# Altium project FRONT.PrjPcb (part 1 of 2)
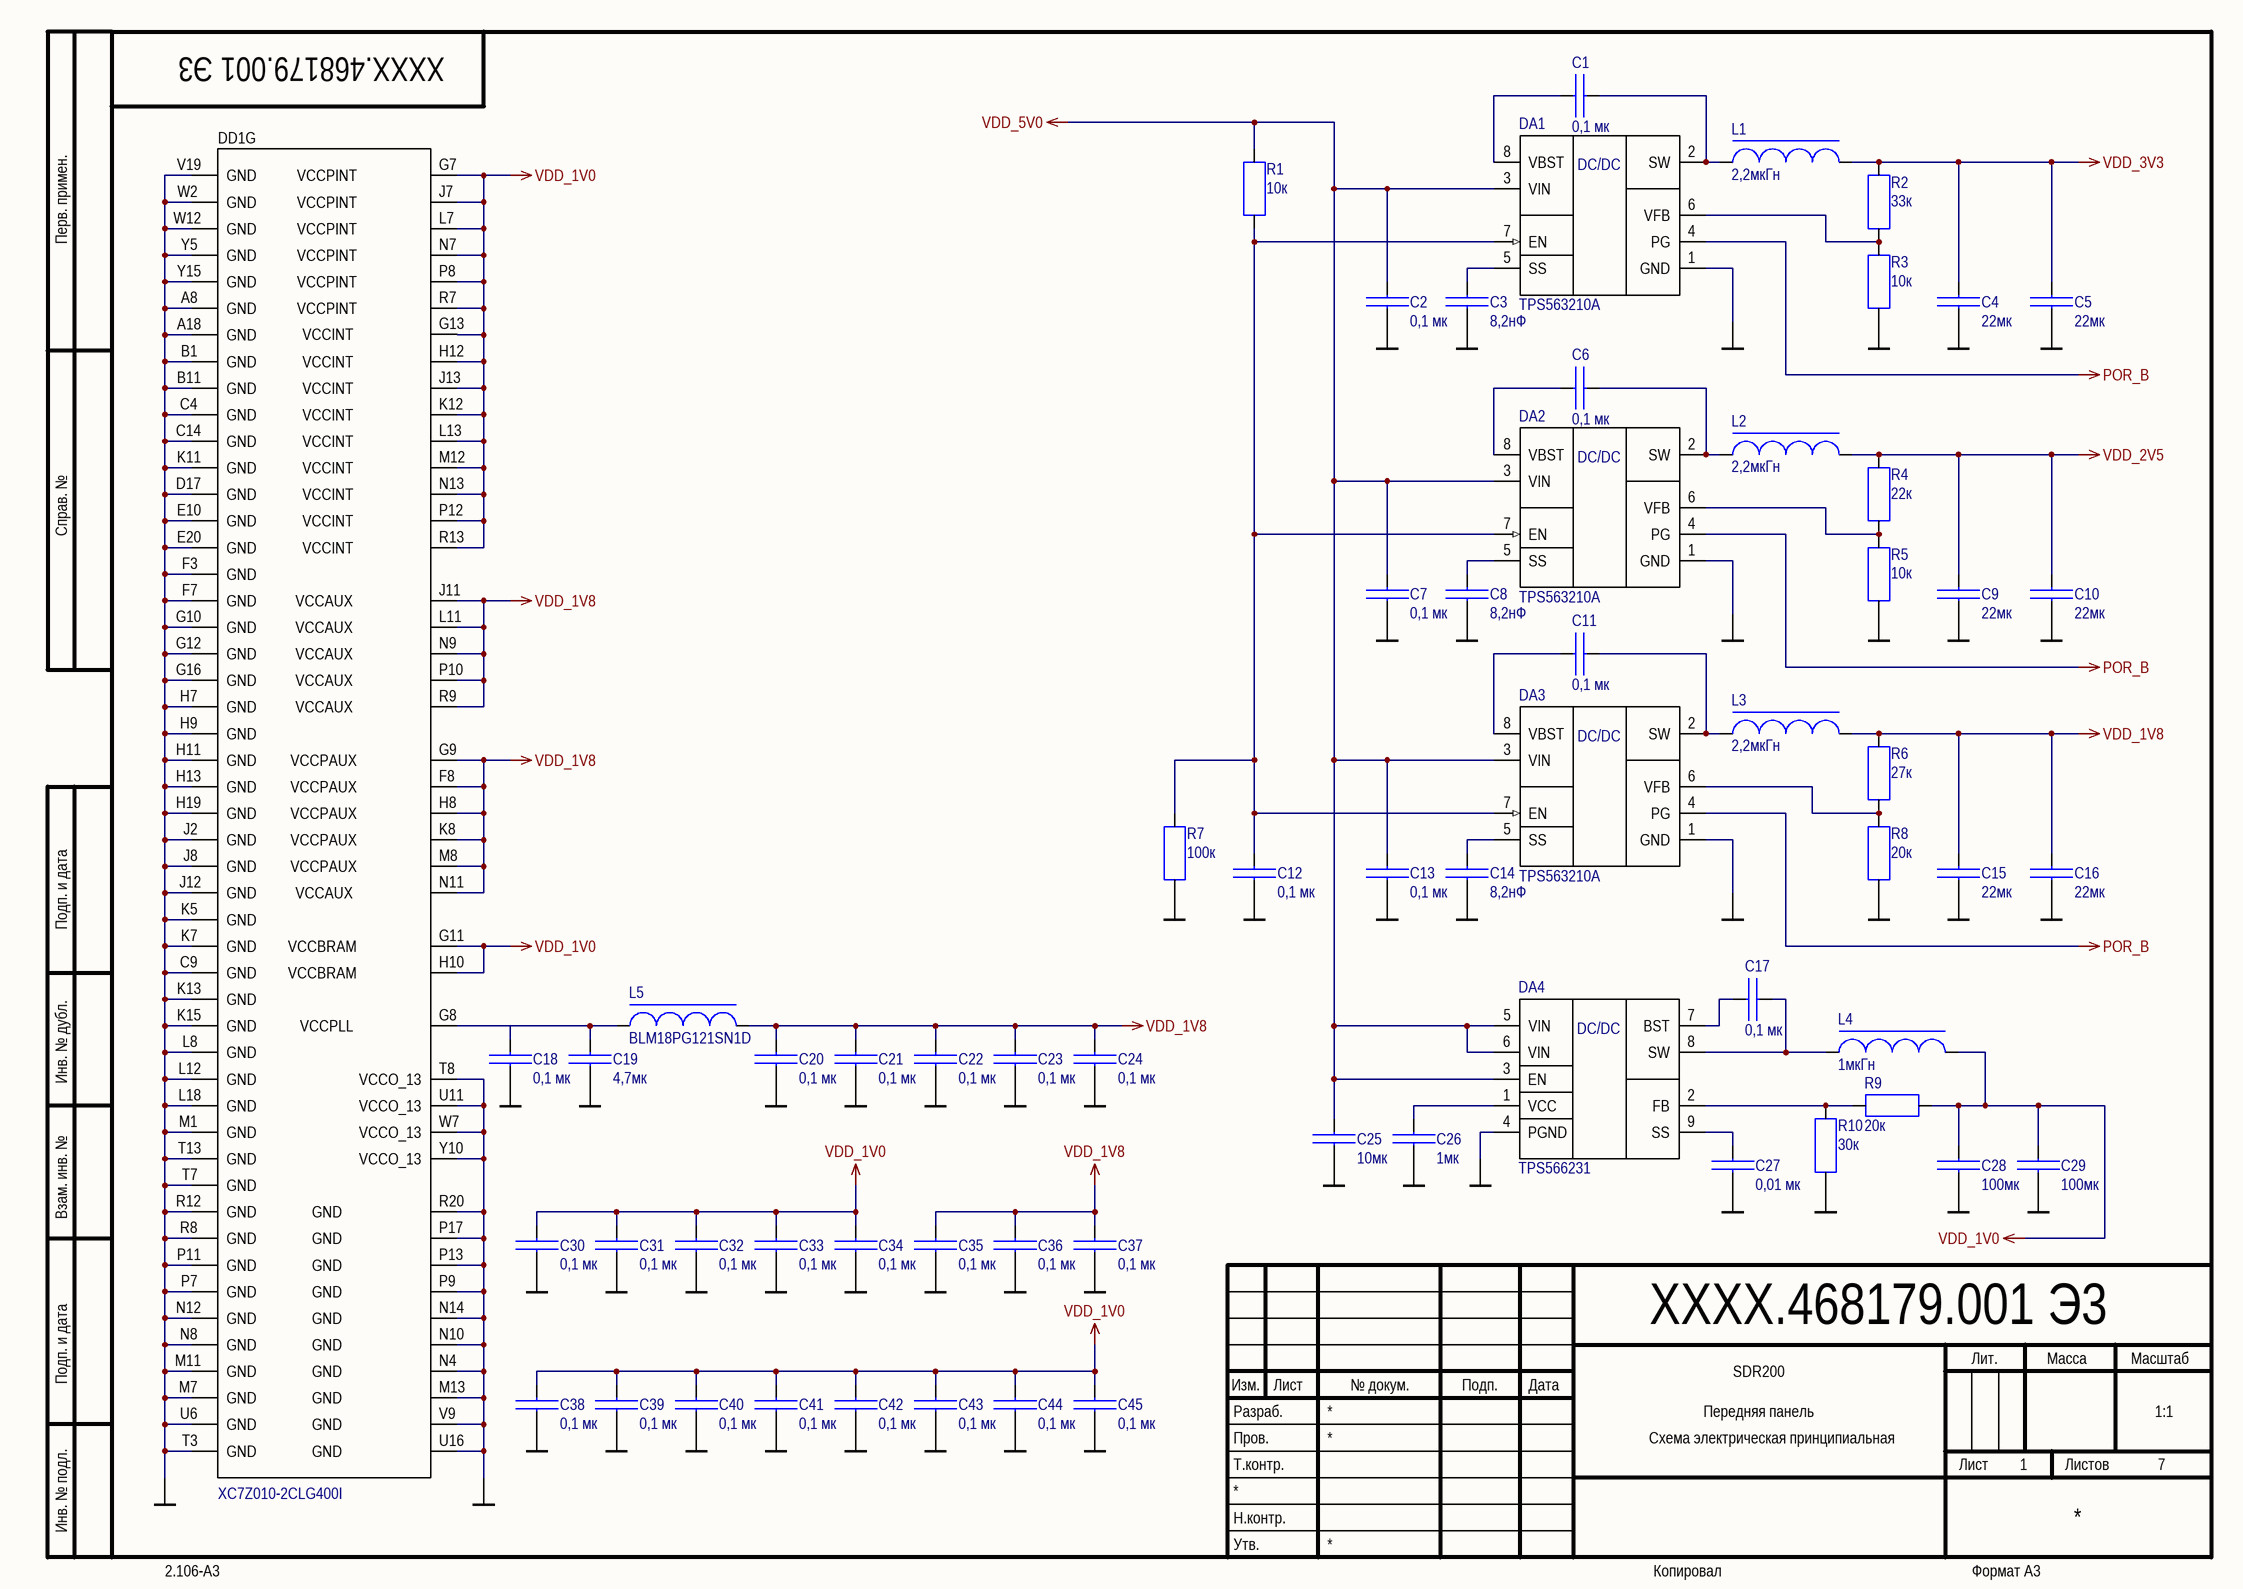
[diagram p0: FRONT_PWR.SchDoc]
7 sheets, 321 parts. Net scope: global (net labels, ports and power ports of the same name join across sheets).
Board file: FRONT_v1.PcbDoc
Sheets:
  FRONT_PWR.SchDoc
  FRONT_PL_v1.SchDoc
  FRONT_LCD.SchDoc
  FRONT_DDR.SchDoc
  FRONT_PS.SchDoc
  FRONT_MCU_v1.SchDoc
  FRONT_INTF.SchDoc

## Sheet FRONT_PWR.SchDoc: SDR200
size 420 x 297 mm; DocumentNumber: XXXX.468179.001 Э3; SheetNumber: 1; SheetTotal: 7; Title2str: Передняя панель; DocumentType: Схема электрическая принципиальная; Scale: 1:1

### Parts
C1  Nominal: 0,1 мк  [CAPC1005X05L]  (hidden comment: CC0402KRX5R6BB104)
C2  Nominal: 0,1 мк  [CAPC1005X05L]  (hidden comment: CC0402KRX5R6BB104)
C3  Nominal: 8,2нФ  [CAPC1005X05L]  (hidden comment: CC0402KRX7R9BB822)
C4  Nominal: 22мк  [CAPC2012X09L]  (hidden comment: CC0805MKX5R5BB226)
C5  Nominal: 22мк  [CAPC2012X09L]  (hidden comment: CC0805MKX5R5BB226)
C6  Nominal: 0,1 мк  [CAPC1005X05L]  (hidden comment: CC0402KRX5R6BB104)
C7  Nominal: 0,1 мк  [CAPC1005X05L]  (hidden comment: CC0402KRX5R6BB104)
C8  Nominal: 8,2нФ  [CAPC1005X05L]  (hidden comment: CC0402KRX7R9BB822)
C9  Nominal: 22мк  [CAPC2012X09L]  (hidden comment: CC0805MKX5R5BB226)
C10  Nominal: 22мк  [CAPC2012X09L]  (hidden comment: CC0805MKX5R5BB226)
C11  Nominal: 0,1 мк  [CAPC1005X05L]  (hidden comment: CC0402KRX5R6BB104)
C12  Nominal: 0,1 мк  [CAPC1005X05L]  (hidden comment: CC0402KRX5R6BB104)
C13  Nominal: 0,1 мк  [CAPC1005X05L]  (hidden comment: CC0402KRX5R6BB104)
C14  Nominal: 8,2нФ  [CAPC1005X05L]  (hidden comment: CC0402KRX7R9BB822)
C15  Nominal: 22мк  [CAPC2012X09L]  (hidden comment: CC0805MKX5R5BB226)
C16  Nominal: 22мк  [CAPC2012X09L]  (hidden comment: CC0805MKX5R5BB226)
C17  Nominal: 0,1 мк  [CAPC1005X05L]  (hidden comment: CC0402KRX5R6BB104)
C18  Nominal: 0,1 мк  [CAPC1005X05L]  (hidden comment: CC0402KRX5R6BB104)
C19  Nominal: 4,7мк  [CAPC1608X08L]  (hidden comment: CC0603KRX5R6BB475)
C20  Nominal: 0,1 мк  [CAPC1005X05L]  (hidden comment: CC0402KRX5R6BB104)
C21  Nominal: 0,1 мк  [CAPC1005X05L]  (hidden comment: CC0402KRX5R6BB104)
C22  Nominal: 0,1 мк  [CAPC1005X05L]  (hidden comment: CC0402KRX5R6BB104)
C23  Nominal: 0,1 мк  [CAPC1005X05L]  (hidden comment: CC0402KRX5R6BB104)
C24  Nominal: 0,1 мк  [CAPC1005X05L]  (hidden comment: CC0402KRX5R6BB104)
C25  Nominal: 10мк  [CAPC2012X09L]  (hidden comment: CC0805KKX5R8BB106)
C26  Nominal: 1мк  [CAPC1005X05L]  (hidden comment: CC0402KRX5R5BB105)
C27  Nominal: 0,01 мк  [CAPC1005X05L]  (hidden comment: CC0402KRX7R9BB103)
C28  Nominal: 100мк  [CAPC3216X12L]  (hidden comment: CC1206MKX5R5BB107)
C29  Nominal: 100мк  [CAPC3216X12L]  (hidden comment: CC1206MKX5R5BB107)
C30  Nominal: 0,1 мк  [CAPC1005X05L]  (hidden comment: CC0402KRX5R6BB104)
C31  Nominal: 0,1 мк  [CAPC1005X05L]  (hidden comment: CC0402KRX5R6BB104)
C32  Nominal: 0,1 мк  [CAPC1005X05L]  (hidden comment: CC0402KRX5R6BB104)
C33  Nominal: 0,1 мк  [CAPC1005X05L]  (hidden comment: CC0402KRX5R6BB104)
C34  Nominal: 0,1 мк  [CAPC1005X05L]  (hidden comment: CC0402KRX5R6BB104)
C35  Nominal: 0,1 мк  [CAPC1005X05L]  (hidden comment: CC0402KRX5R6BB104)
C36  Nominal: 0,1 мк  [CAPC1005X05L]  (hidden comment: CC0402KRX5R6BB104)
C37  Nominal: 0,1 мк  [CAPC1005X05L]  (hidden comment: CC0402KRX5R6BB104)
C38  Nominal: 0,1 мк  [CAPC1005X05L]  (hidden comment: CC0402KRX5R6BB104)
C39  Nominal: 0,1 мк  [CAPC1005X05L]  (hidden comment: CC0402KRX5R6BB104)
C40  Nominal: 0,1 мк  [CAPC1005X05L]  (hidden comment: CC0402KRX5R6BB104)
C41  Nominal: 0,1 мк  [CAPC1005X05L]  (hidden comment: CC0402KRX5R6BB104)
C42  Nominal: 0,1 мк  [CAPC1005X05L]  (hidden comment: CC0402KRX5R6BB104)
C43  Nominal: 0,1 мк  [CAPC1005X05L]  (hidden comment: CC0402KRX5R6BB104)
C44  Nominal: 0,1 мк  [CAPC1005X05L]  (hidden comment: CC0402KRX5R6BB104)
C45  Nominal: 0,1 мк  [CAPC1005X05L]  (hidden comment: CC0402KRX5R6BB104)
DA1  TPS563210A  [TSOP65P280X110-8L]
DA2  TPS563210A  [TSOP65P280X110-8L]
DA3  TPS563210A  [TSOP65P280X110-8L]
DA4  TPS566231  [VQFN-HR 9]
DD1  XC7Z010-2CLG400I  [BGA400C80P20X20_1700X1700X147]  (part G of 7)
L1  Nominal: 2,2мкГн  [INDCXGL4020]  (hidden comment: XGL4020-222ME)
L2  Nominal: 2,2мкГн  [INDCXGL4020]  (hidden comment: XGL4020-222ME)
L3  Nominal: 2,2мкГн  [INDCXGL4020]  (hidden comment: XGL4020-222ME)
L4  Nominal: 1мкГн  [INDCXGL4020]  (hidden comment: XGL4020-102ME)
L5  BLM18PG121SN1D  [INDC1608X05L]
R1  Nominal: 10к  [RESC1005X04L]  (hidden comment: RC0402JR-0710KL)
R2  Nominal: 33к  [RESC1005X04L]  (hidden comment: RC0402JR-0733KL)
R3  Nominal: 10к  [RESC1005X04L]  (hidden comment: RC0402JR-0710KL)
R4  Nominal: 22к  [RESC1005X04L]  (hidden comment: RC0402JR-0722KL)
R5  Nominal: 10к  [RESC1005X04L]  (hidden comment: RC0402JR-0710KL)
R6  Nominal: 27к  [RESC1005X04L]  (hidden comment: RC0402JR-0727KL)
R7  Nominal: 100к  [RESC1005X04L]  (hidden comment: RC0402JR-07100KL)
R8  Nominal: 20к  [RESC1005X04L]  (hidden comment: RC0402JR-0720KL)
R9  Nominal: 20к  [RESC1005X04L]  (hidden comment: RC0402JR-0720KL)
R10  Nominal: 30к  [RESC1005X04L]  (hidden comment: RC0402JR-0730KL)

### Nets
GND: C2.1 C3.1 C4.1 C5.1 C7.1 C8.1 C9.1 C10.1 C12.1 C13.1 C14.1 C15.1 C16.1 C18.2 C19.1 C20.2 C21.2 C22.2 C23.2 C24.2 C25.1 C26.1 C27.1 C28.1 C29.1 C30.2 C31.2 C32.2 C33.2 C34.2 C35.2 C36.2 C37.2 C38.2 C39.2 C40.2 C41.2 C42.2 C43.2 C44.2 C45.2 DA1.1(GND) DA2.1(GND) DA3.1(GND) DA4.4(PGND) DD1.A8(GND) DD1.A18(GND) DD1.B1(GND) DD1.B11(GND) DD1.C4(GND) DD1.C9(GND) DD1.C14(GND) DD1.D17(GND) DD1.E10(GND) DD1.E20(GND) DD1.F3(GND) DD1.F7(GND) DD1.G10(GND) DD1.G12(GND) DD1.G16(GND) DD1.H7(GND) DD1.H9(GND) DD1.H11(GND) DD1.H13(GND) DD1.H19(GND) DD1.J2(GND) DD1.J8(GND) DD1.J12(GND) DD1.K5(GND) DD1.K7(GND) DD1.K11(GND) DD1.K13(GND) DD1.K15(GND) DD1.L8(GND) DD1.L12(GND) DD1.L18(GND) DD1.M1(GND) DD1.M7(GND) DD1.M11(GND) DD1.M13(GND) DD1.N4(GND) DD1.N8(GND) DD1.N10(GND) DD1.N12(GND) DD1.N14(GND) DD1.P7(GND) DD1.P9(GND) DD1.P11(GND) DD1.P13(GND) DD1.P17(GND) DD1.R8(GND) DD1.R12(GND) DD1.R20(GND) DD1.T3(GND) DD1.T7(GND) DD1.T8(VCCO_13) DD1.T13(GND) DD1.U6(GND) DD1.U11(VCCO_13) DD1.U16(GND) DD1.V9(GND) DD1.V19(GND) DD1.W2(GND) DD1.W7(VCCO_13) DD1.W12(GND) DD1.Y5(GND) DD1.Y10(VCCO_13) DD1.Y15(GND) R3.2 R5.2 R7.1 R8.2 R10.1
POR_B: DA1.4(PG) DA2.4(PG) DA3.4(PG)
VDD_1V0: C28.2 C29.2 C30.1 C31.1 C32.1 C33.1 C34.1 C38.1 C39.1 C40.1 C41.1 C42.1 C43.1 C44.1 C45.1 DD1.G7(VCCPINT) DD1.G11(VCCBRAM) DD1.H10(VCCBRAM) DD1.H12(VCCINT) DD1.J7(VCCPINT) DD1.J13(VCCINT) DD1.K12(VCCINT) DD1.L7(VCCPINT) DD1.L13(VCCINT) DD1.M12(VCCINT) DD1.N7(VCCPINT) DD1.N13(VCCINT) DD1.P8(VCCPINT) DD1.P12(VCCINT) DD1.R7(VCCPINT) DD1.R13(VCCINT) L4.1 R9.1
VDD_1V8: C15.2 C16.2 C20.1 C21.1 C22.1 C23.1 C24.1 C35.1 C36.1 C37.1 DD1.F8(VCCPAUX) DD1.G9(VCCPAUX) DD1.H8(VCCPAUX) DD1.J11(VCCAUX) DD1.K8(VCCPAUX) DD1.L11(VCCAUX) DD1.M8(VCCPAUX) DD1.N9(VCCAUX) DD1.N11(VCCAUX) DD1.P10(VCCAUX) DD1.R9(VCCAUX) L3.1 L5.1 R6.1
VDD_2V5: C9.2 C10.2 L2.1 R4.1
VDD_3V3: C4.2 C5.2 L1.1 R2.1
VDD_5V0: C2.2 C7.2 C13.2 C25.2 DA1.3(VIN) DA2.3(VIN) DA3.3(VIN) DA4.3(EN) DA4.5(VIN) DA4.6(VIN) R1.1  [project net BL_PWR]
NetC1_1: C1.1 DA1.8(VBST)
NetC1_2: C1.2 DA1.2(SW) L1.2
NetC3_2: C3.2 DA1.5(SS)
NetC6_1: C6.1 DA2.8(VBST)
NetC6_2: C6.2 DA2.2(SW) L2.2
NetC8_2: C8.2 DA2.5(SS)
NetC11_1: C11.1 DA3.8(VBST)
NetC11_2: C11.2 DA3.2(SW) L3.2
NetC12_2: C12.2 DA1.7(EN) DA2.7(EN) DA3.7(EN) R1.2 R7.2
NetC14_2: C14.2 DA3.5(SS)
NetC17_1: C17.1 DA4.7(BST)
NetC17_2: C17.2 DA4.8(SW) L4.2
NetC18_1: C18.1 C19.2 DD1.G8(VCCPLL) L5.2
NetC26_2: C26.2 DA4.1(VCC)
NetC27_2: C27.2 DA4.9(SS)
NetDA1_6: DA1.6(VFB) R2.2 R3.1
NetDA2_6: DA2.6(VFB) R4.2 R5.1
NetDA3_6: DA3.6(VFB) R6.2 R8.1
NetDA4_2: DA4.2(FB) R9.2 R10.2

Not connected (* = marked no-connect by the designer): DD1 G13  (VCCINT___________________)

### Notes on the sheet
- Перв. примен.
- Справ. №
- Подп. и дата
- Инв. № дубл.
- Взам. инв. №
- Разраб.
- Изм.
- Лист
- № докум.
- Подп.
- Дата
- Лит.
- Масса
- Масштаб
- Пров.
- Т.контр.
- Листов
- Инв. № подл.
- Утв.
- Н.контр.
- 2.106-A3
- Копировал
- Формат А3
- (in symbol TPS563210A) DC/DC
- (in symbol TPS566231) DC/DC

### Library data of the parts
C1 C2 C6 C7 C11-C13 C17 C18 C20-C24 C30-C45 = CC0402KRX5R6BB104: ЧИП конденсатор; Manufacturer: Yageo; ID: 0402 0,1 мкФ 10В X7R; Tolerance: 10%; Type: X7R; Value: 0402 0,1 мкФ 10В X7R; RuNominal: 0,1 мкФ; Voltage: 10В; ManufacturerPartNumber: CC0402KRX5R6BB104; Rem: *
C3 C8 C14 = CC0402KRX7R9BB822: ЧИП конденсатор; Manufacturer: Yageo; ID: 0402 8,2 нФ 50В X7R; Tolerance: 10%; Type: X7R; Value: 0402 8,2 нФ 50В X7R; RuNominal: 8,2 нФ; Voltage: 50В; ManufacturerPartNumber: CC0402KRX7R9BB822; Rem: *
C4 C5 C9 C10 C15 C16 = CC0805MKX5R5BB226: ЧИП конденсатор; Manufacturer: Yageo; ID: 0805 22 мкФ 6,3В X5R; Tolerance: 0,2; Type: X5R; Value: 0805 22 мкФ 6,3В X5R; RuNominal: 22 мкФ; Voltage: 6,3В; ManufacturerPartNumber: CC0805MKX5R5BB226; Rem: *
C19 = CC0603KRX5R6BB475: ЧИП конденсатор; Manufacturer: Yageo; ID: 0603 4,7 мкФ 10В X5R; Tolerance: 10%; Type: X5R; Value: 0603 4,7 мкФ 10В X5R; RuNominal: 4,7 мкФ; Voltage: 10В; ManufacturerPartNumber: CC0603KRX5R6BB475; Rem: *
C25 = CC0805KKX5R8BB106: ЧИП конденсатор; Manufacturer: Yageo; ID: 0805 10 мкФ 25В X7R; Tolerance: 0,1; Type: X7R; Value: 0805 10 мкФ 25В X7R; RuNominal: 10 мкФ; Voltage: 25В; ManufacturerPartNumber: CC0805KKX5R8BB106; Rem: *
C26 = CC0402KRX5R5BB105: ЧИП конденсатор; Manufacturer: Yageo; ID: 0402 1 мкФ 6,3В X5R; Tolerance: 10%; Type: X5R; Value: 0402 1 мкФ 6,3В X5R; RuNominal: 1 мкФ; Voltage: 6,3В; ManufacturerPartNumber: CC0402KRX5R5BB105; Rem: *
C27 = CC0402KRX7R9BB103: ЧИП конденсатор; Manufacturer: Yageo; ID: 0402 10 нФ 50В X7R; Tolerance: 10%; Type: X7R; Value: 0402 10 нФ 50В X7R; RuNominal: 10 нФ; Voltage: 50В; ManufacturerPartNumber: CC0402KRX7R9BB103; Rem: *
C28 C29 = CC1206MKX5R5BB107: ЧИП конденсатор; Manufacturer: Yageo; ID: 1206 100 мкФ 6,3В X5R; Tolerance: 20%; Type: X5R; Value: 1206 100 мкФ 6,3В X5R; RuNominal: 100 мкФ; Voltage: 6,3В; ManufacturerPartNumber: CC1206MKX5R5BB107; Rem: *
DA1-DA3 = TPS563210A: TPS56x210A, 4.5-V to 17-V Input, 2-A, 3-A Synchrono; Manufacturer: TI; Value: TPS563210A; ComponentLink1Description: datasheet; ComponentLink1URL: https://www.ti.com/lit/ds/symlink/tps563210a.pdf?ts=1769179342855&ref_url=https%253A%252F%252Fwww.ti.com%252Fproduct%252FTPS563210A; ManufacturerPartNumber: TPS563210A; Rem: *
DA4 = TPS566231: 3-V to 18-V Input, 6-A Synchronous Step-Down Voltage Regulator; Value: TPS566231; ComponentLink1Description: datasheet; ComponentLink1URL: https://www.ti.com/lit/ds/symlink/tps566231.pdf?ts=1764277568408
DD1 = XC7Z010-2CLG400I: Zynq®-7000 SoC Family; Manufacturer: Xilinx; ManufacturerPartNumber: XC7Z010-2CLG400I; Value: XC7Z010-2CLG400I
L1-L3 = XGL4020-222ME: Shielded Power Inductors; Manufacturer: Coilcraft; ID: XGL4020 2,2мкГн; Value: XGL4020 2,2мкГн; Current: 2,7А; DC Res: 19,5mOhms; ManufacturerPartNumber: XGL4020-222ME
L4 = XGL4020-102ME: Shielded Power Inductors; Manufacturer: Coilcraft; ID: XGL4020 1мкГн; Value: XGL4020 1мкГн; Current: 3,8А; DC Res: 8,2mOhms; ManufacturerPartNumber: XGL4020-102ME
L5 = BLM18PG121SN1D: Chip Ferrite Beads (0603 Size); Manufacturer: Murata; Rem: 120ohm ±25%; Current: 2000mA; DC Res: 0.05ohm; Nominal: BLM18PG121SN1D; ID: BLM18PG121SN1D; ManufacturerPartNumber: BLM18PG121SN1D; Value: BLM18PG121SN1D
R1 R3 R5 = RC0402JR-0710KL: ЧИП резистор; Manufacturer: Yageo; ID: 0402 10 кОм 5%; Tolerance: 5%; Value: 0402 10 кОм 5%; ManufacturerPartNumber: RC0402JR-0710KL; Rem: *; Type: *
R2 = RC0402JR-0733KL: ЧИП резистор; Manufacturer: Yageo; ID: 0402 33 кОм 5%; Tolerance: 5%; Value: 0402 33 кОм 5%; ManufacturerPartNumber: RC0402JR-0733KL; Rem: *; Type: *
R4 = RC0402JR-0722KL: ЧИП резистор; Manufacturer: Yageo; ID: 0402 22 кОм 5%; Tolerance: 5%; Value: 0402 22 кОм 5%; ManufacturerPartNumber: RC0402JR-0722KL; Rem: *; Type: *
R6 = RC0402JR-0727KL: ЧИП резистор; Manufacturer: Yageo; ID: 0402 27 кОм 5%; Tolerance: 5%; Value: 0402 27 кОм 5%; ManufacturerPartNumber: RC0402JR-0727KL; Rem: *; Type: *
R7 = RC0402JR-07100KL: ЧИП резистор; Manufacturer: Yageo; ID: 0402 100 кОм 5%; Tolerance: 5%; Value: 0402 100 кОм 5%; ManufacturerPartNumber: RC0402JR-07100KL; Rem: *; Type: *
R8 R9 = RC0402JR-0720KL: ЧИП резистор; Manufacturer: Yageo; ID: 0402 20 кОм 5%; Tolerance: 5%; Value: 0402 20 кОм 5%; ManufacturerPartNumber: RC0402JR-0720KL; Rem: *; Type: *
R10 = RC0402JR-0730KL: ЧИП резистор; Manufacturer: Yageo; ID: 0402 30 кОм 5%; Tolerance: 5%; Value: 0402 30 кОм 5%; ManufacturerPartNumber: RC0402JR-0730KL; Rem: *; Type: *

## Sheet FRONT_PL_v1.SchDoc: SDR200
size 420 x 297 mm; DocumentNumber: XXXX.468179.001 Э3; SheetNumber: 2; SheetTotal: 7; Title2str: Передняя панель; DocumentType: Схема электрическая принципиальная; Scale: 1:1
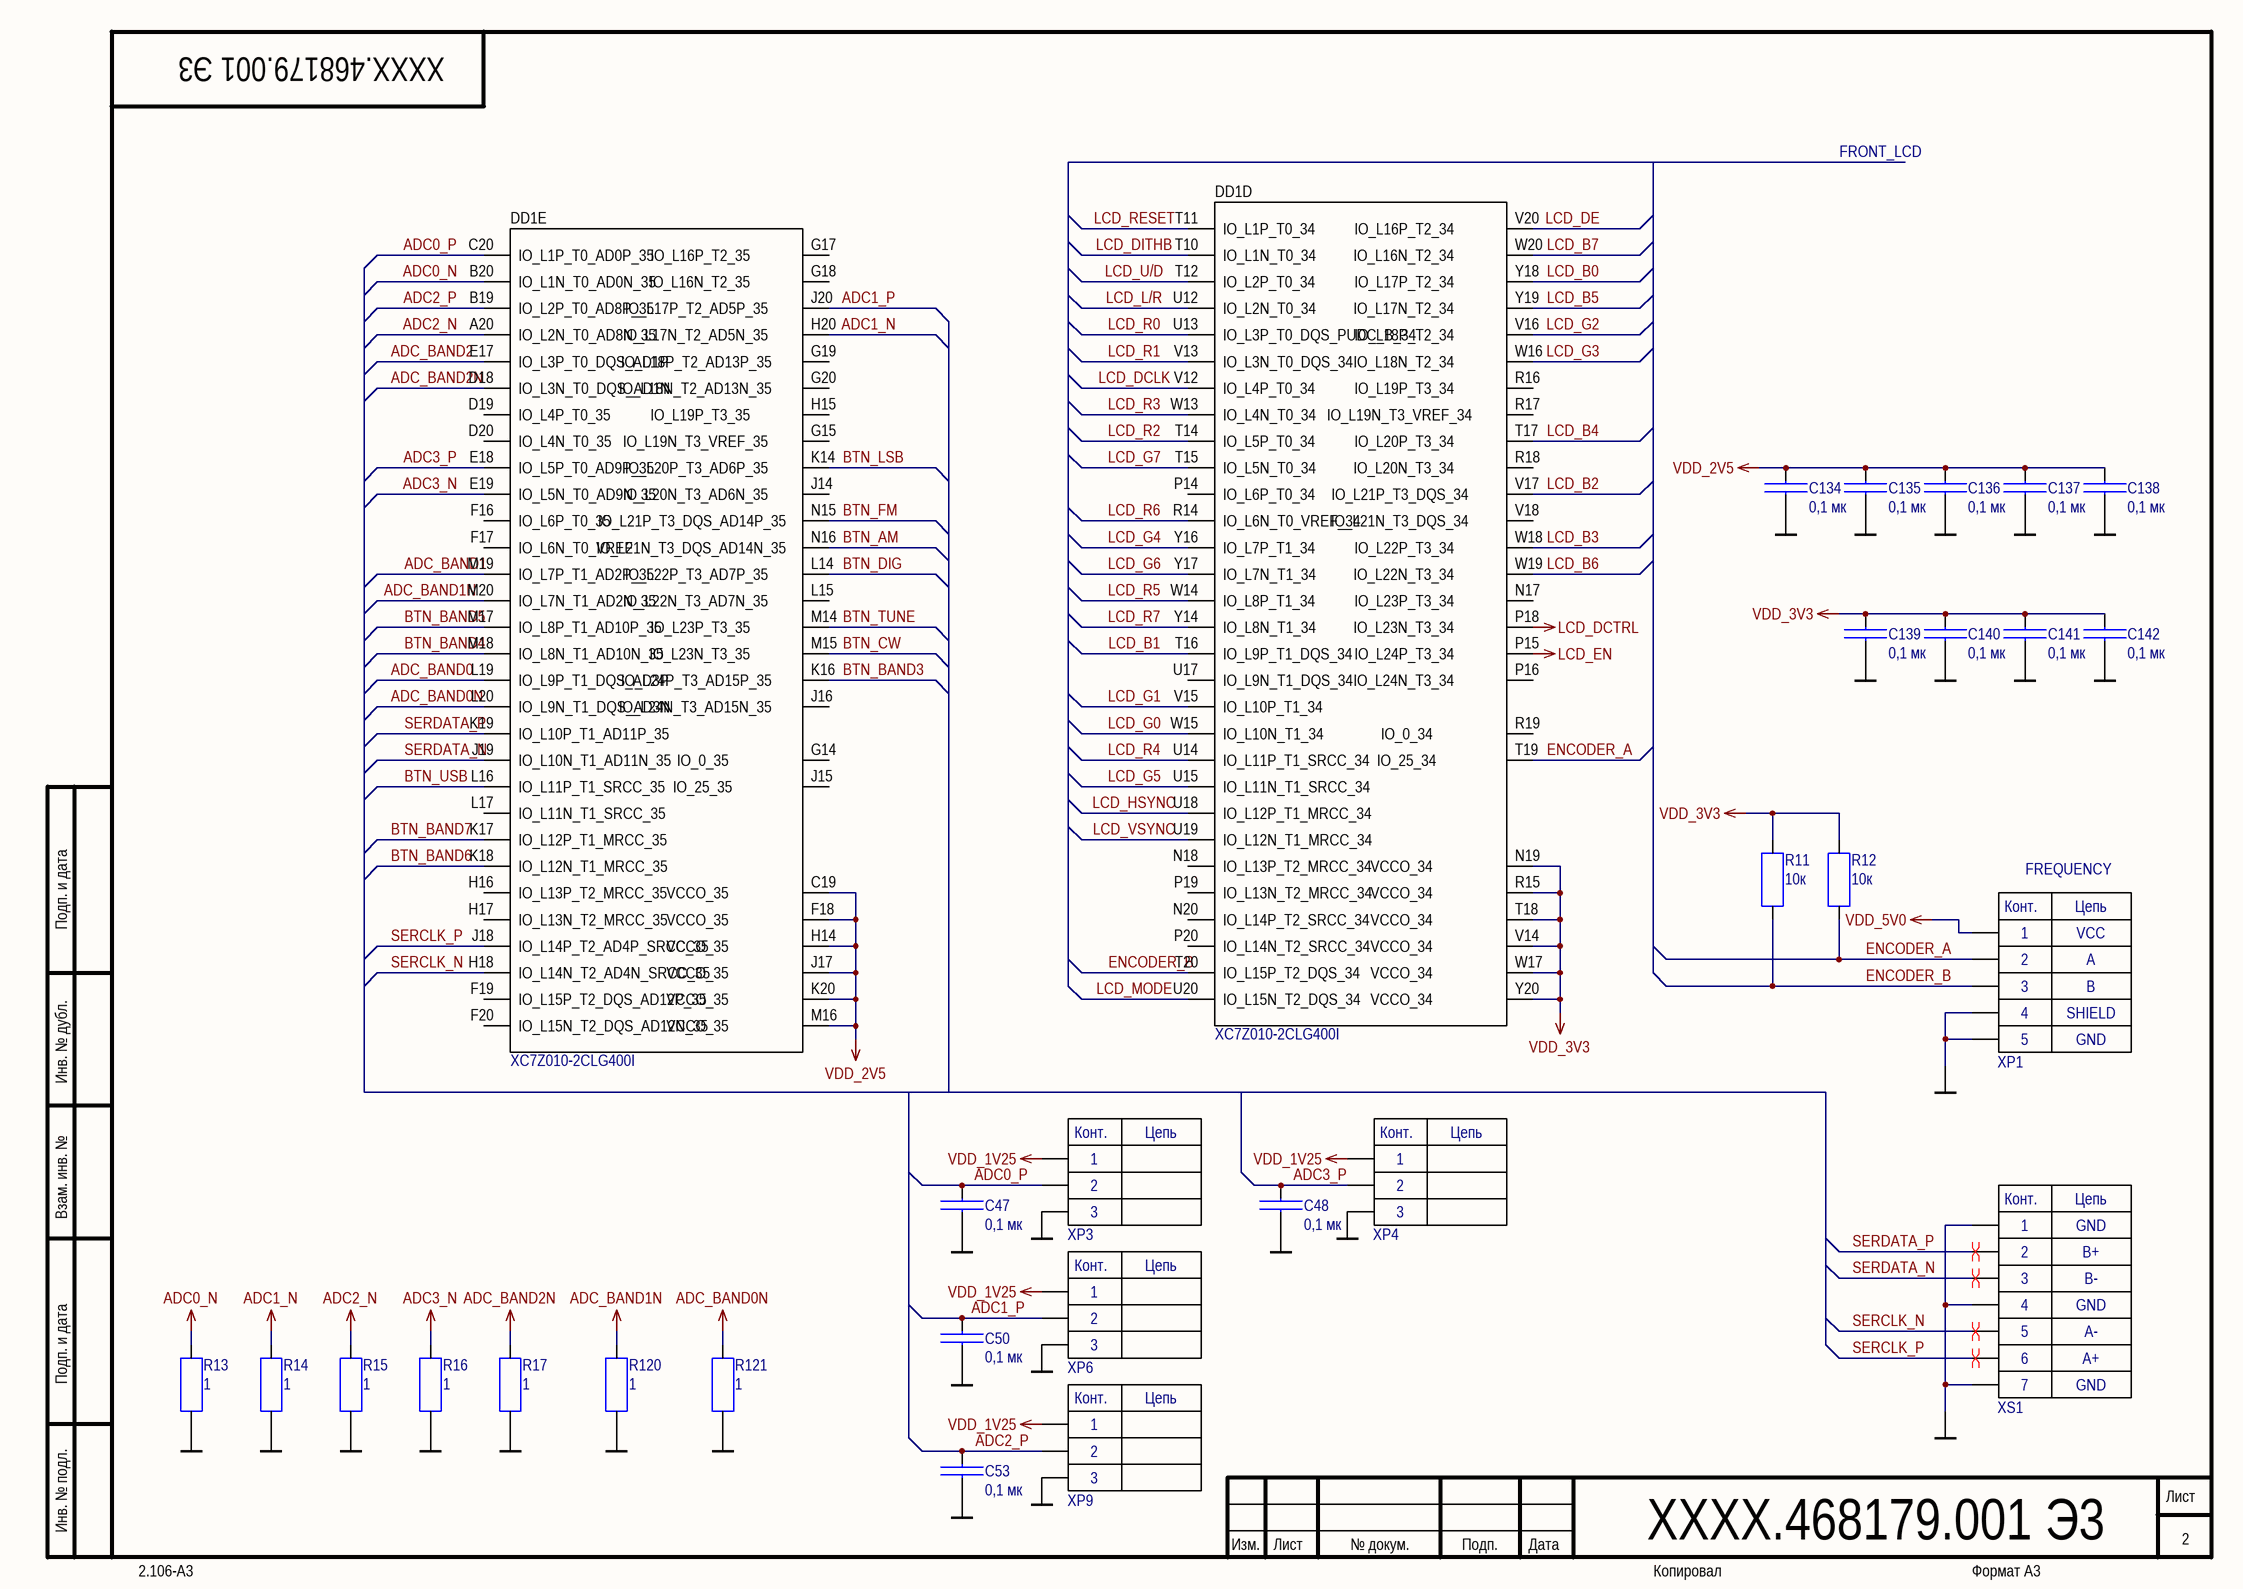
[diagram p1: FRONT_PL_v1.SchDoc]

### Parts
C47  Nominal: 0,1 мк  [CAPC1005X05L]  (hidden comment: CC0402KRX5R6BB104)
C48  Nominal: 0,1 мк  [CAPC1005X05L]  (hidden comment: CC0402KRX5R6BB104)
C50  Nominal: 0,1 мк  [CAPC1005X05L]  (hidden comment: CC0402KRX5R6BB104)
C53  Nominal: 0,1 мк  [CAPC1005X05L]  (hidden comment: CC0402KRX5R6BB104)
C134  Nominal: 0,1 мк  [CAPC1005X05L]  (hidden comment: CC0402KRX5R6BB104)
C135  Nominal: 0,1 мк  [CAPC1005X05L]  (hidden comment: CC0402KRX5R6BB104)
C136  Nominal: 0,1 мк  [CAPC1005X05L]  (hidden comment: CC0402KRX5R6BB104)
C137  Nominal: 0,1 мк  [CAPC1005X05L]  (hidden comment: CC0402KRX5R6BB104)
C138  Nominal: 0,1 мк  [CAPC1005X05L]  (hidden comment: CC0402KRX5R6BB104)
C139  Nominal: 0,1 мк  [CAPC1005X05L]  (hidden comment: CC0402KRX5R6BB104)
C140  Nominal: 0,1 мк  [CAPC1005X05L]  (hidden comment: CC0402KRX5R6BB104)
C141  Nominal: 0,1 мк  [CAPC1005X05L]  (hidden comment: CC0402KRX5R6BB104)
C142  Nominal: 0,1 мк  [CAPC1005X05L]  (hidden comment: CC0402KRX5R6BB104)
DD1  XC7Z010-2CLG400I  [BGA400C80P20X20_1700X1700X147]  (parts D,E of 7)
R11  Nominal: 10к  [RESC1005X04L]  (hidden comment: RC0402JR-0710KL)
R12  Nominal: 10к  [RESC1005X04L]  (hidden comment: RC0402JR-0710KL)
R13  Nominal: 1  [RESC1005X04L]  (hidden comment: RC0402JR-071RL)
R14  Nominal: 1  [RESC1005X04L]  (hidden comment: RC0402JR-071RL)
R15  Nominal: 1  [RESC1005X04L]  (hidden comment: RC0402JR-071RL)
R16  Nominal: 1  [RESC1005X04L]  (hidden comment: RC0402JR-071RL)
R17  Nominal: 1  [RESC1005X04L]  (hidden comment: RC0402JR-071RL)
R120  Nominal: 1  [RESC1005X04L]  (hidden comment: RC0402JR-071RL)
R121  Nominal: 1  [RESC1005X04L]  (hidden comment: RC0402JR-071RL)
XP1  WB-05  [WB-05 (MW-5M) pitch 2.00mm]  (value not drawn)
XP3  WB-03  [WB-03 (MW-3M) PITCH 2.00MM]  (value not drawn)
XP4  WB-03  [WB-03 (MW-3M) PITCH 2.00MM]  (value not drawn)
XP6  WB-03  [WB-03 (MW-3M) PITCH 2.00MM]  (value not drawn)
XP9  WB-03  [WB-03 (MW-3M) PITCH 2.00MM]  (value not drawn)
XS1  KLS1-SATA001  [KLS1-SATA001]  (value not drawn)

### Nets
ADC0_N: DD1.B20(IO_L1N_T0_AD0N_35) R13.2
ADC1_N: DD1.H20(IO_L17N_T2_AD5N_35) R14.2
ADC2_N: DD1.A20(IO_L2N_T0_AD8N_35) R15.2
ADC3_N: DD1.E19(IO_L5N_T0_AD9N_35) R16.2
ADC_BAND0N: DD1.L20(IO_L9N_T1_DQS_AD3N) R121.2
ADC_BAND1N: DD1.M20(IO_L7N_T1_AD2N_35) R120.2
ADC_BAND2N: DD1.D18(IO_L3N_T0_DQS_AD1N) R17.2
GND: C47.1 C48.1 C50.1 C53.1 C134.1 C135.1 C136.1 C137.1 C138.1 C139.1 C140.1 C141.1 C142.1 R13.1 R14.1 R15.1 R16.1 R17.1 R120.1 R121.1 XP1.4 XP1.5 XP3.3 XP4.3 XP6.3 XP9.3 XS1.1 XS1.4 XS1.7
LCD_DCTRL: DD1.P18(IO_L23N_T3_34)
LCD_EN: DD1.P15(IO_L24P_T3_34)
VDD_1V25: XP3.1 XP4.1 XP6.1 XP9.1
VDD_2V5: C134.2 C135.2 C136.2 C137.2 C138.2 DD1.C19(VCCO_35) DD1.F18(VCCO_35) DD1.H14(VCCO_35) DD1.J17(VCCO_35) DD1.K20(VCCO_35) DD1.M16(VCCO_35)
VDD_3V3: C139.2 C140.2 C141.2 C142.2 DD1.N19(VCCO_34) DD1.R15(VCCO_34) DD1.T18(VCCO_34) DD1.V14(VCCO_34) DD1.W17(VCCO_34) DD1.Y20(VCCO_34) R11.1 R12.1
VDD_5V0: XP1.1  [project net BL_PWR]
ADC0_P: C47.2 DD1.C20(IO_L1P_T0_AD0P_35) XP3.2
ADC1_P: C50.2 DD1.J20(IO_L17P_T2_AD5P_35) XP6.2
ADC2_P: C53.2 DD1.B19(IO_L2P_T0_AD8P_35) XP9.2
ADC3_P: C48.2 DD1.E18(IO_L5P_T0_AD9P_35) XP4.2
ADC_BAND0: DD1.L19(IO_L9P_T1_DQS_AD3P)
ADC_BAND1: DD1.M19(IO_L7P_T1_AD2P_35)
ADC_BAND2: DD1.E17(IO_L3P_T0_DQS_AD1P)
BTN_AM: DD1.N16(IO_L21N_T3_DQS_AD14N_35)
BTN_BAND3: DD1.K16(IO_L24P_T3_AD15P_35)
BTN_BAND4: DD1.M18(IO_L8N_T1_AD10N_35)
BTN_BAND5: DD1.M17(IO_L8P_T1_AD10P_35)
BTN_BAND6: DD1.K18(IO_L12N_T1_MRCC_35)
BTN_BAND7: DD1.K17(IO_L12P_T1_MRCC_35)
BTN_CW: DD1.M15(IO_L23N_T3_35)
BTN_DIG: DD1.L14(IO_L22P_T3_AD7P_35)
BTN_FM: DD1.N15(IO_L21P_T3_DQS_AD14P_35)
BTN_LSB: DD1.K14(IO_L20P_T3_AD6P_35)
BTN_TUNE: DD1.M14(IO_L23P_T3_35)
BTN_USB: DD1.L16(IO_L11P_T1_SRCC_35)
ENCODER_A: DD1.T19(IO_25_34) R12.2 XP1.2
ENCODER_B: DD1.T20(IO_L15P_T2_DQS_34) R11.2 XP1.3
LCD_B0: DD1.Y18(IO_L17P_T2_34)
LCD_B1: DD1.T16(IO_L9P_T1_DQS_34)
LCD_B2: DD1.V17(IO_L21P_T3_DQS_34)
LCD_B3: DD1.W18(IO_L22P_T3_34)
LCD_B4: DD1.T17(IO_L20P_T3_34)
LCD_B5: DD1.Y19(IO_L17N_T2_34)
LCD_B6: DD1.W19(IO_L22N_T3_34)
LCD_B7: DD1.W20(IO_L16N_T2_34)
LCD_DCLK: DD1.V12(IO_L4P_T0_34)
LCD_DE: DD1.V20(IO_L16P_T2_34)
LCD_DITHB: DD1.T10(IO_L1N_T0_34)
LCD_G0: DD1.W15(IO_L10N_T1_34)
LCD_G1: DD1.V15(IO_L10P_T1_34)
LCD_G2: DD1.V16(IO_L18P_T2_34)
LCD_G3: DD1.W16(IO_L18N_T2_34)
LCD_G4: DD1.Y16(IO_L7P_T1_34)
LCD_G5: DD1.U15(IO_L11N_T1_SRCC_34)
LCD_G6: DD1.Y17(IO_L7N_T1_34)
LCD_G7: DD1.T15(IO_L5N_T0_34)
LCD_HSYNC: DD1.U18(IO_L12P_T1_MRCC_34)
LCD_L/R: DD1.U12(IO_L2N_T0_34)
LCD_MODE: DD1.U20(IO_L15N_T2_DQS_34)
LCD_R0: DD1.U13(IO_L3P_T0_DQS_PUDC_B_34)
LCD_R1: DD1.V13(IO_L3N_T0_DQS_34)
LCD_R2: DD1.T14(IO_L5P_T0_34)
LCD_R3: DD1.W13(IO_L4N_T0_34)
LCD_R4: DD1.U14(IO_L11P_T1_SRCC_34)
LCD_R5: DD1.W14(IO_L8P_T1_34)
LCD_R6: DD1.R14(IO_L6N_T0_VREF_34)
LCD_R7: DD1.Y14(IO_L8N_T1_34)
LCD_RESET: DD1.T11(IO_L1P_T0_34)
LCD_U/D: DD1.T12(IO_L2P_T0_34)
LCD_VSYNC: DD1.U19(IO_L12N_T1_MRCC_34)
SERCLK_N: DD1.H18(IO_L14N_T2_AD4N_SRCC_35) XS1.5
SERCLK_P: DD1.J18(IO_L14P_T2_AD4P_SRCC_35) XS1.6
SERDATA_N: DD1.J19(IO_L10N_T1_AD11N_35) XS1.3
SERDATA_P: DD1.K19(IO_L10P_T1_AD11P_35) XS1.2

Not connected (* = marked no-connect by the designer): DD1 D19  (IO_L4P_T0_35_____________) D20  (IO_L4N_T0_35_____________) F16  (IO_L6P_T0_35_____________) F17  (IO_L6N_T0_VREF) F19  (IO_L15P_T2_DQS_AD12P_35__) F20  (IO_L15N_T2_DQS_AD12N_35__) G14  (IO_0_35__________________) G15  (IO_L19N_T3_VREF_35_______) G17  (IO_L16P_T2_35____________) G18  (IO_L16N_T2_35____________) G19  (IO_L18P_T2_AD13P_35______) G20  (IO_L18N_T2_AD13N_35______) H15  (IO_L19P_T3_35____________) H16  (IO_L13P_T2_MRCC_35_______) H17  (IO_L13N_T2_MRCC_35_______) J14  (IO_L20N_T3_AD6N_35_______) J15  (IO_25_35_________________) J16  (IO_L24N_T3_AD15N_35______) L15  (IO_L22N_T3_AD7N_35_______) L17  (IO_L11N_T1_SRCC_35_______) N17  (IO_L23P_T3_34____________) N18  (IO_L13P_T2_MRCC_34_______) N20  (IO_L14P_T2_SRCC_34_______) P14  (IO_L6P_T0_34_____________) P16  (IO_L24N_T3_34____________) P19  (IO_L13N_T2_MRCC_34_______) P20  (IO_L14N_T2_SRCC_34_______) R16  (IO_L19P_T3_34____________) R17  (IO_L19N_T3_VREF_34_______) R18  (IO_L20N_T3_34____________) R19  (IO_0_34__________________) U17  (IO_L9N_T1_DQS_34_________) V18  (IO_L21N_T3_DQS_34________)

### Layout directives
differential pair: SERCLK_N, SERCLK_P, SERDATA_N, SERDATA_P

### Notes on the sheet
- FRONT_LCD
- FREQUENCY
- VCC
- A
- B
- GND
- SHIELD
- Подп. и дата
- Инв. № дубл.
- Взам. инв. №
- Инв. № подл.
- Изм.
- Лист
- № докум.
- Подп.
- Дата
- 2.106-A3
- Копировал
- Формат А3
- (in symbol SATA KLS1-SATA001) Конт.; Цепь; GND; B+; B-; A-; A+
- (in symbol WB-03) Конт.; Цепь
- (in symbol WB-05) Конт.; Цепь

### Library data of the parts
C47 C48 C50 C53 C134-C142 = CC0402KRX5R6BB104: as C1 on sheet FRONT_PWR; ManufacturerPartNumber: CC0402KRX5R6BB104; Rem: *
DD1 = XC7Z010-2CLG400I: as DD1 on sheet FRONT_PWR; ManufacturerPartNumber: XC7Z010-2CLG400I; Value: XC7Z010-2CLG400I
R11 R12 = RC0402JR-0710KL: as R1 on sheet FRONT_PWR; ManufacturerPartNumber: RC0402JR-0710KL; Rem: *; Type: *
R13-R17 R120 R121 = RC0402JR-071RL: ЧИП резистор; Manufacturer: Yageo; ID: 0402 1 Ом 5%; Tolerance: 5%; Value: 0402 1 Ом 5%; ManufacturerPartNumber: RC0402JR-071RL; Rem: *; Type: *
XP1 = WB-05: WB-05 (MW-5M) pitch 2.00mm / DS1066-05M; ManufacturerPartNumber: WB-05
XP3 XP4 XP6 XP9 = WB-03: WB-03(MW-3M) pitch 2.00mm / DS1066-03M
XS1 = SATA KLS1-SATA001: SATA Type A 7P Male Connector,SMD

## Sheet FRONT_LCD.SchDoc: SDR200
size 420 x 297 mm; DocumentNumber: XXXX.468179.001 Э3; SheetNumber: 3; SheetTotal: 7; Title2str: Передняя панель; DocumentType: Схема электрическая принципиальная; Scale: 1:1
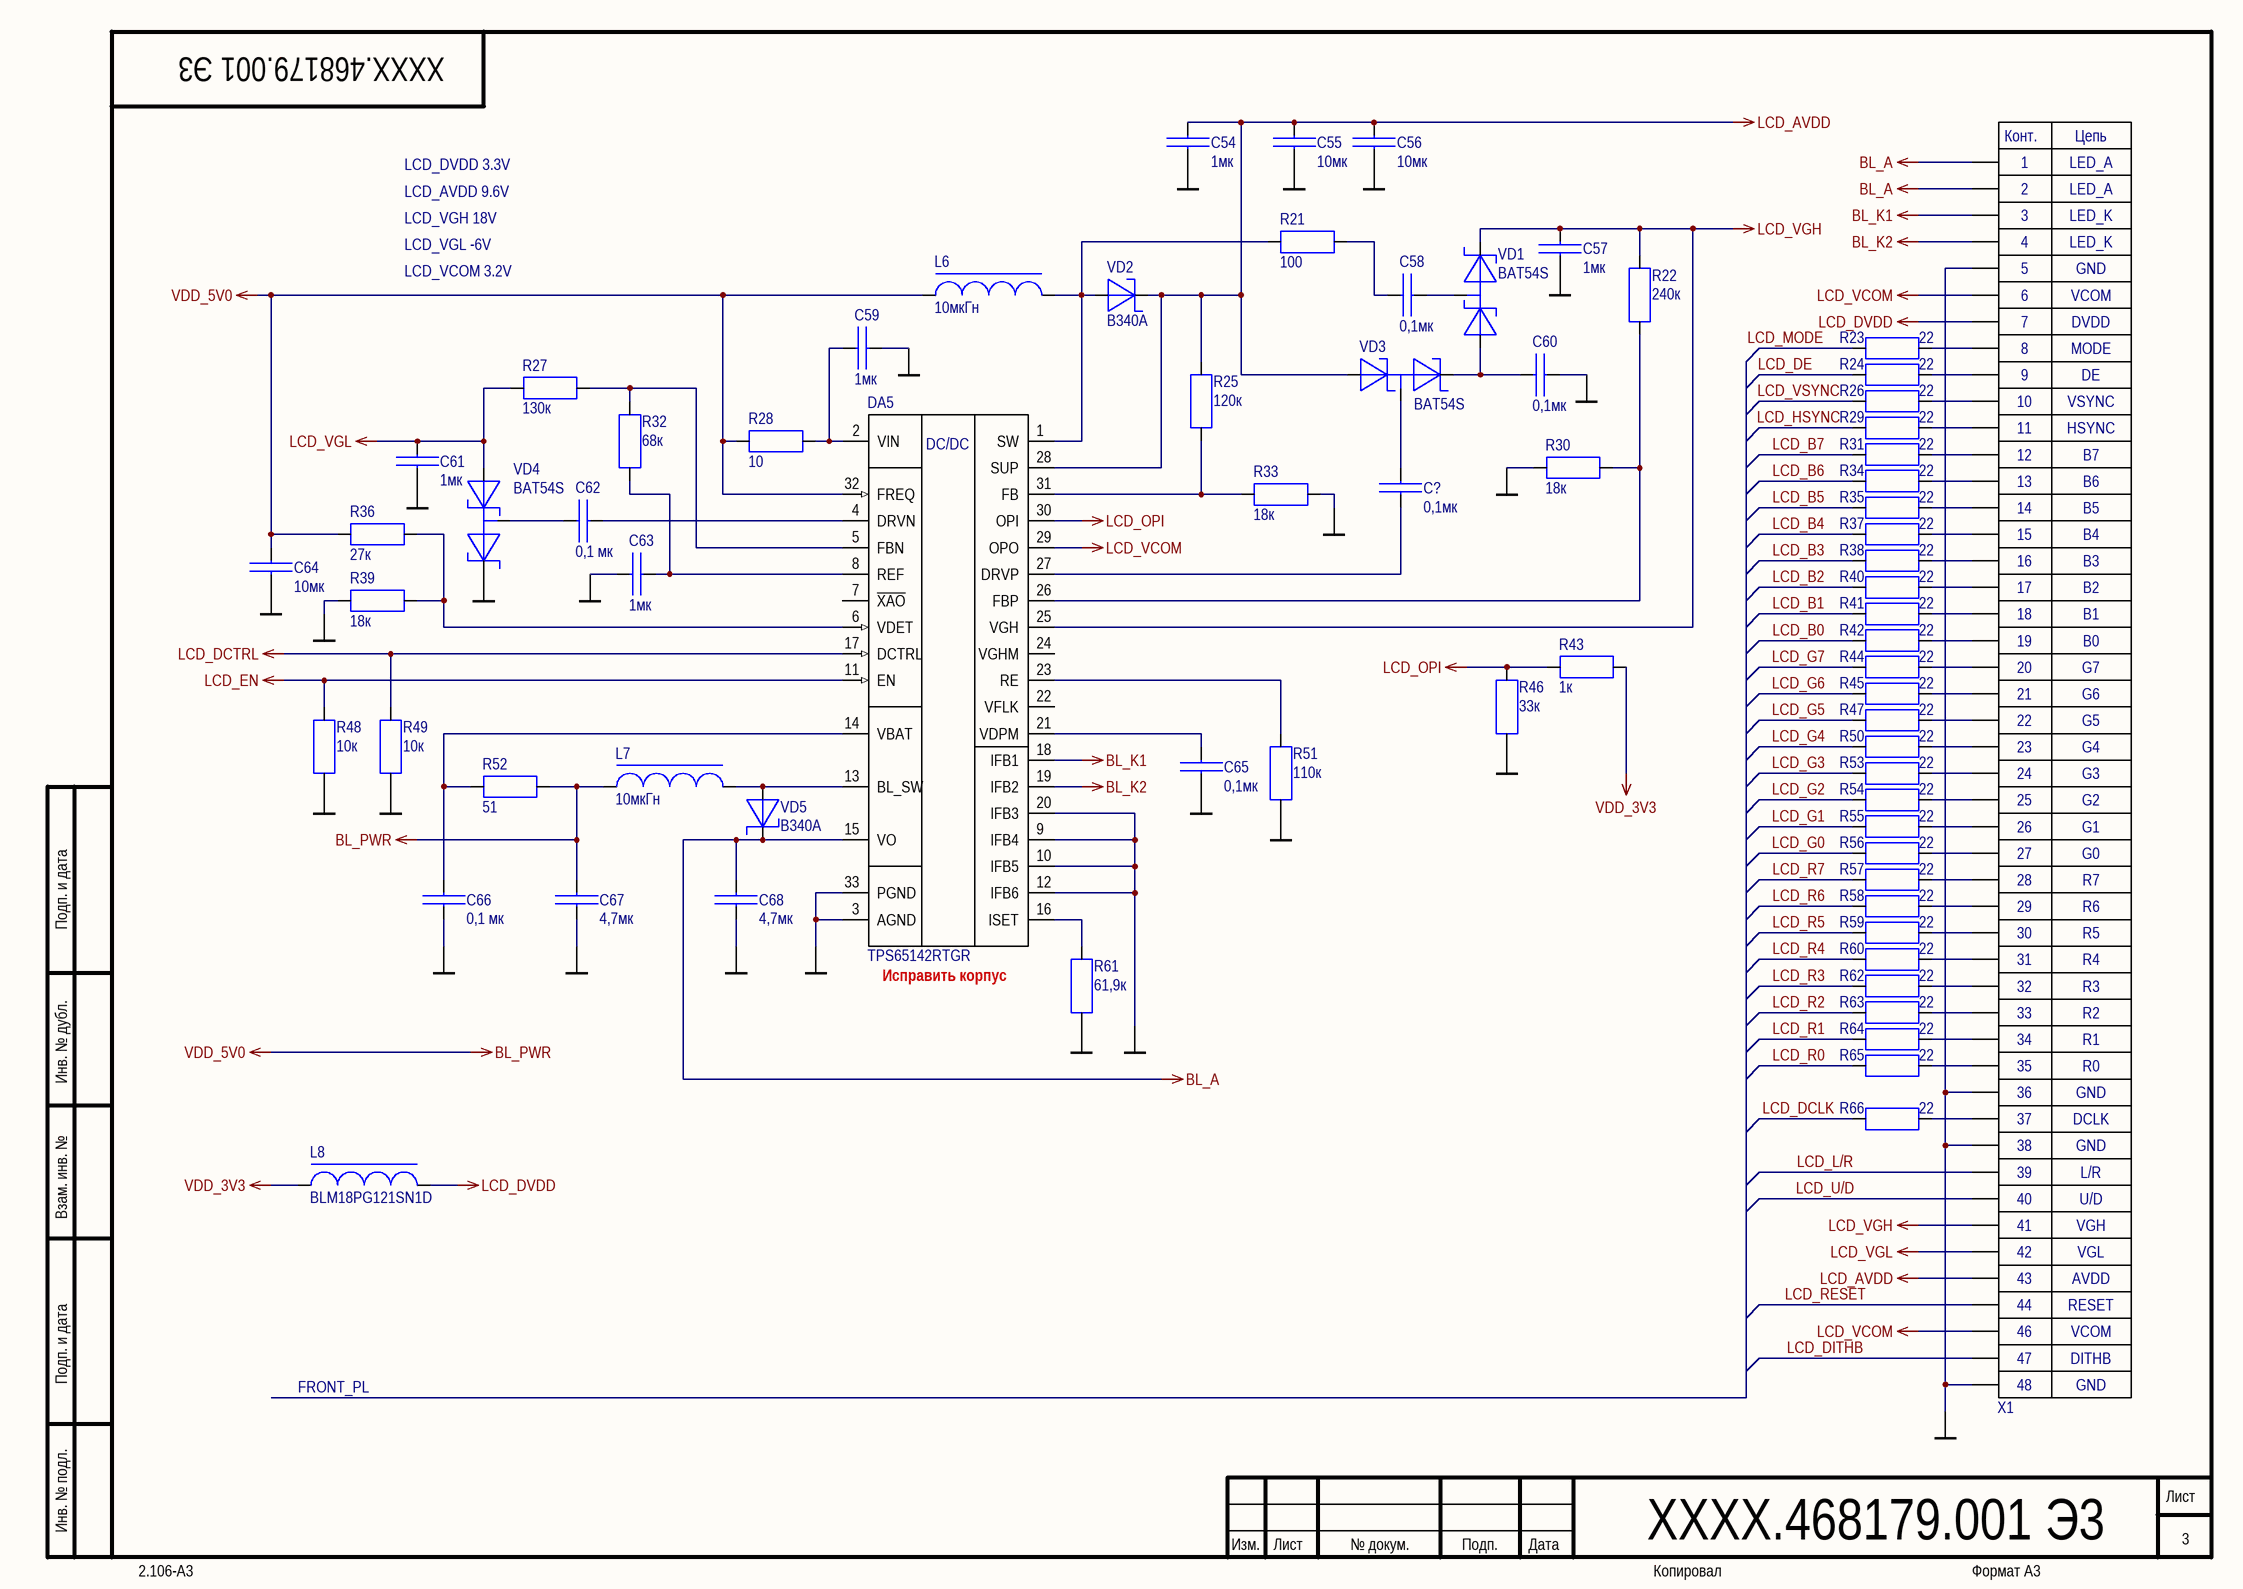
[diagram p2: FRONT_LCD.SchDoc]

### Parts
C54  Nominal: 1мк  [CAPC1608X08L]  (hidden comment: CC0603KRX7R9BB105)
C55  Nominal: 10мк  [CAPC2012X09L]  (hidden comment: CC0805KKX5R8BB106)
C56  Nominal: 10мк  [CAPC2012X09L]  (hidden comment: CC0805KKX5R8BB106)
C57  Nominal: 1мк  [CAPC1608X08L]  (hidden comment: CC0603KRX7R9BB105)
C58  Nominal: 0,1мк  [CAPC1608X08L]  (hidden comment: CC0603KRX7R9BB103)
C59  Nominal: 1мк  [CAPC1608X08L]  (hidden comment: CC0603KRX7R9BB105)
C60  Nominal: 0,1мк  [CAPC1608X08L]  (hidden comment: CC0603KRX7R9BB103)
C61  Nominal: 1мк  [CAPC1608X08L]  (hidden comment: CC0603KRX7R9BB105)
C62  Nominal: 0,1 мк  [CAPC1005X05L]  (hidden comment: CC0402KRX5R6BB104)
C63  Nominal: 1мк  [CAPC1608X08L]  (hidden comment: CC0603KRX7R9BB105)
C64  Nominal: 10мк  [CAPC2012X09L]  (hidden comment: CC0805KKX5R8BB106)
C65  Nominal: 0,1мк  [CAPC1608X08L]  (hidden comment: CC0603KRX7R9BB103)
C66  Nominal: 0,1 мк  [CAPC1005X05L]  (hidden comment: CC0402KRX5R6BB104)
C67  Nominal: 4,7мк  [CAPC2012X09L]  (hidden comment: CC0805KKX7R8BB475)
C68  Nominal: 4,7мк  [CAPC2012X09L]  (hidden comment: CC0805KKX7R8BB475)
C?  Nominal: 0,1мк  [CAPC1608X08L]  (hidden comment: CC0603KRX7R9BB103)
DA5  TPS65142RTGR  [PQFN40P600X300X80_HS-33N]
L6  Nominal: 10мкГн  [INDC1812PS]  (hidden comment: 1812PS-103KR)
L7  Nominal: 10мкГн  [INDC1812PS]  (hidden comment: 1812PS-103KR)
L8  BLM18PG121SN1D  [INDC1608X05L]
R21  Nominal: 100  [RESC1005X04L]  (hidden comment: RC0402JR-07100RL)
R22  Nominal: 240к  [RESC1005X04L]  (hidden comment: RC0402JR-07240KL)
R23  Nominal: 22  [RESC1005X04L]  (hidden comment: RC0402JR-0722RL)
R24  Nominal: 22  [RESC1005X04L]  (hidden comment: RC0402JR-0722RL)
R25  Nominal: 120к  [RESC1005X04L]  (hidden comment: RC0402JR-07120KL)
R26  Nominal: 22  [RESC1005X04L]  (hidden comment: RC0402JR-0722RL)
R27  Nominal: 130к  [RESC1005X04L]  (hidden comment: RC0402JR-07130KL)
R28  Nominal: 10  [RESC1005X04L]  (hidden comment: RC0402JR-0710RL)
R29  Nominal: 22  [RESC1005X04L]  (hidden comment: RC0402JR-0722RL)
R30  Nominal: 18к  [RESC1005X04L]  (hidden comment: RC0402JR-0718KL)
R31  Nominal: 22  [RESC1005X04L]  (hidden comment: RC0402JR-0722RL)
R32  Nominal: 68к  [RESC1005X04L]  (hidden comment: RC0402JR-0768KL)
R33  Nominal: 18к  [RESC1005X04L]  (hidden comment: RC0402JR-0718KL)
R34  Nominal: 22  [RESC1005X04L]  (hidden comment: RC0402JR-0722RL)
R35  Nominal: 22  [RESC1005X04L]  (hidden comment: RC0402JR-0722RL)
R36  Nominal: 27к  [RESC1005X04L]  (hidden comment: RC0402JR-0727KL)
R37  Nominal: 22  [RESC1005X04L]  (hidden comment: RC0402JR-0722RL)
R38  Nominal: 22  [RESC1005X04L]  (hidden comment: RC0402JR-0722RL)
R39  Nominal: 18к  [RESC1005X04L]  (hidden comment: RC0402JR-0718KL)
R40  Nominal: 22  [RESC1005X04L]  (hidden comment: RC0402JR-0722RL)
R41  Nominal: 22  [RESC1005X04L]  (hidden comment: RC0402JR-0722RL)
R42  Nominal: 22  [RESC1005X04L]  (hidden comment: RC0402JR-0722RL)
R43  Nominal: 1к  [RESC1005X04L]  (hidden comment: RC0402JR-071KL)
R44  Nominal: 22  [RESC1005X04L]  (hidden comment: RC0402JR-0722RL)
R45  Nominal: 22  [RESC1005X04L]  (hidden comment: RC0402JR-0722RL)
R46  Nominal: 33к  [RESC1005X04L]  (hidden comment: RC0402JR-0733KL)
R47  Nominal: 22  [RESC1005X04L]  (hidden comment: RC0402JR-0722RL)
R48  Nominal: 10к  [RESC1005X04L]  (hidden comment: RC0402JR-0710KL)
R49  Nominal: 10к  [RESC1005X04L]  (hidden comment: RC0402JR-0710KL)
R50  Nominal: 22  [RESC1005X04L]  (hidden comment: RC0402JR-0722RL)
R51  Nominal: 110к  [RESC1005X04L]  (hidden comment: RC0402JR-07110KL)
R52  Nominal: 51  [RESC1005X04L]  (hidden comment: RC0402JR-0751RL)
R53  Nominal: 22  [RESC1005X04L]  (hidden comment: RC0402JR-0722RL)
R54  Nominal: 22  [RESC1005X04L]  (hidden comment: RC0402JR-0722RL)
R55  Nominal: 22  [RESC1005X04L]  (hidden comment: RC0402JR-0722RL)
R56  Nominal: 22  [RESC1005X04L]  (hidden comment: RC0402JR-0722RL)
R57  Nominal: 22  [RESC1005X04L]  (hidden comment: RC0402JR-0722RL)
R58  Nominal: 22  [RESC1005X04L]  (hidden comment: RC0402JR-0722RL)
R59  Nominal: 22  [RESC1005X04L]  (hidden comment: RC0402JR-0722RL)
R60  Nominal: 22  [RESC1005X04L]  (hidden comment: RC0402JR-0722RL)
R61  Nominal: 61,9к  [RESC1005X04L]  (hidden comment: RC0402FR-0761K9L)
R62  Nominal: 22  [RESC1005X04L]  (hidden comment: RC0402JR-0722RL)
R63  Nominal: 22  [RESC1005X04L]  (hidden comment: RC0402JR-0722RL)
R64  Nominal: 22  [RESC1005X04L]  (hidden comment: RC0402JR-0722RL)
R65  Nominal: 22  [RESC1005X04L]  (hidden comment: RC0402JR-0722RL)
R66  Nominal: 22  [RESC1005X04L]  (hidden comment: RC0402JR-0722RL)
VD1  BAT54S  [SOT95P240X120-3L]
VD2  B340A  [DIOM5127X23L]
VD3  BAT54S  [SOT95P240X120-3L]
VD4  BAT54S  [SOT95P240X120-3L]
VD5  B340A  [DIOM5127X23L]
X1  LCD 50p  [CON_541325062_MOL]  (value not drawn)

### Nets
BL_A: C68.2 DA5.15(VO) VD5.1(K) X1.1 X1.2
BL_K1: DA5.18(IFB1) X1.3
BL_K2: DA5.19(IFB2) X1.4
BL_PWR: C64.1 C67.2 DA5.32(FREQ) L6.2 L7.2 R28.1 R36.1 R52.1  [also labelled VDD_5V0]
GND: C54.1 C55.2 C56.2 C57.1 C59.1 C60.2 C61.1 C63.1 C64.2 C65.1 C66.1 C67.1 C68.1 DA5.3(AGND) DA5.9(IFB4) DA5.10(IFB5) DA5.12(IFB6) DA5.20(IFB3) DA5.33(PGND) R30.1 R33.2 R39.1 R46.1 R48.2 R49.2 R51.1 R61.1 VD4.3(K) X1.5 X1.36 X1.38 X1.48
LCD_AVDD: C54.2 C55.1 C56.1 DA5.28(SUP) R25.1 VD2.1(K) VD3.2(A) X1.43
LCD_DCTRL: DA5.17(DCTRL) R49.1
LCD_DVDD: L8.1 X1.7
LCD_EN: DA5.11(EN) R48.1
LCD_OPI: DA5.30(OPI) R43.2 R46.2
LCD_VCOM: DA5.29(OPO) X1.6 X1.46
LCD_VGH: C57.2 DA5.25(VGH) R22.1 VD1.3(K) X1.41
LCD_VGL: C61.2 R27.1 VD4.2(A) X1.42
VDD_3V3: L8.2 R43.1
LCD_B0: R42.2
LCD_B1: R41.2
LCD_B2: R40.2
LCD_B3: R38.2
LCD_B4: R37.2
LCD_B5: R35.2
LCD_B6: R34.2
LCD_B7: R31.2
LCD_DCLK: R66.2
LCD_DE: R24.2
LCD_DITHB: X1.47
LCD_G0: R56.2
LCD_G1: R55.2
LCD_G2: R54.2
LCD_G3: R53.2
LCD_G4: R50.2
LCD_G5: R47.2
LCD_G6: R45.2
LCD_G7: R44.2
LCD_HSYNC: R29.2
LCD_L/R: X1.39
LCD_MODE: R23.2
LCD_R0: R65.2
LCD_R1: R64.2
LCD_R2: R63.2
LCD_R3: R62.2
LCD_R4: R60.2
LCD_R5: R59.2
LCD_R6: R58.2
LCD_R7: R57.2
LCD_RESET: X1.44
LCD_U/D: X1.40
LCD_VSYNC: R26.2
NetC58_1: C58.1 R21.1
NetC58_2: C58.2 VD1.1
NetC59_2: C59.2 DA5.2(VIN) R28.2
NetC60_1: C60.1 VD1.2(A) VD3.3(K)
NetC62_1: C62.1 DA5.4(DRVN)
NetC62_2: C62.2 VD4.1
NetC63_2: C63.2 DA5.8(REF) R32.1
NetC65_2: C65.2 DA5.21(VDPM)
NetC66_2: C66.2 DA5.14(VBAT) R52.2
NetC?_1: C?.1 DA5.27(DRVP)
NetC?_2: C?.2 VD3.1
NetDA5_1: DA5.1(SW) L6.1 R21.2 VD2.2(A)
NetDA5_5: DA5.5(FBN) R27.2 R32.2
NetDA5_6: DA5.6(VDET) R36.2 R39.2
NetDA5_13: DA5.13(BL_SW) L7.1 VD5.2(A)
NetDA5_16: DA5.16(ISET) R61.2
NetDA5_23: DA5.23(RE) R51.2
NetDA5_26: DA5.26(FBP) R22.2 R30.2
NetDA5_31: DA5.31(FB) R25.2 R33.1
NetR23_1: R23.1 X1.8
NetR24_1: R24.1 X1.9
NetR26_1: R26.1 X1.10
NetR29_1: R29.1 X1.11
NetR31_1: R31.1 X1.12
NetR34_1: R34.1 X1.13
NetR35_1: R35.1 X1.14
NetR37_1: R37.1 X1.15
NetR38_1: R38.1 X1.16
NetR40_1: R40.1 X1.17
NetR41_1: R41.1 X1.18
NetR42_1: R42.1 X1.19
NetR44_1: R44.1 X1.20
NetR45_1: R45.1 X1.21
NetR47_1: R47.1 X1.22
NetR50_1: R50.1 X1.23
NetR53_1: R53.1 X1.24
NetR54_1: R54.1 X1.25
NetR55_1: R55.1 X1.26
NetR56_1: R56.1 X1.27
NetR57_1: R57.1 X1.28
NetR58_1: R58.1 X1.29
NetR59_1: R59.1 X1.30
NetR60_1: R60.1 X1.31
NetR62_1: R62.1 X1.32
NetR63_1: R63.1 X1.33
NetR64_1: R64.1 X1.34
NetR65_1: R65.1 X1.35
NetR66_1: R66.1 X1.37

Not connected (* = marked no-connect by the designer): DA5 7(~{XAO}) 22(VFLK) 24(VGHM)

### Notes on the sheet
- LCD_DVDD 3.3V
- LCD_AVDD 9.6V
- LCD_VGH 18V
- LCD_VGL -6V
- LCD_VCOM 3.2V
- Исправить корпус
- FRONT_PL
- Подп. и дата
- Инв. № дубл.
- Взам. инв. №
- Инв. № подл.
- Изм.
- Лист
- № докум.
- Подп.
- Дата
- 2.106-A3
- Копировал
- Формат А3
- (in symbol LCD 50p) Конт.; Цепь; LED_A; LED_K; GND; VCOM; DVDD; MODE; DE; VSYNC; HSYNC; B7; B6; B5; B4; B3; B2; B1; B0; G7; G6; G5; G4; G3; G2; G1; G0; R7; R6; R5; R4; R3; R2; R1; R0; DCLK; L/R; U/D; VGH; VGL; AVDD; RESET; DITHB
- (in symbol TPS65142RTGR) DC/DC

### Library data of the parts
C54 C57 C59 C61 C63 = CC0603KRX7R9BB105: ЧИП конденсатор; Manufacturer: Yageo; ID: 0603 1 мкФ 50В X7R; Tolerance: 10%; Type: X7R; Value: 0603 1 мкФ 50В X7R; RuNominal: 1 мкФ; Voltage: 50В; ManufacturerPartNumber: CC0603KRX7R9BB105; Rem: *
C55 C56 C64 = CC0805KKX5R8BB106: as C25 on sheet FRONT_PWR; ManufacturerPartNumber: CC0805KKX5R8BB106; Rem: *
C58 C60 C65 C? = CC0603KRX7R9BB103: ЧИП конденсатор; Manufacturer: Yageo; ID: 0603 0,1 мкФ 50В X7R; Tolerance: 10%; Type: X7R; Value: 0603 0,1 мкФ 50В X7R; RuNominal: 0,1 мкФ; Voltage: 50В; ManufacturerPartNumber: CC0603KRX7R9BB103; Rem: *
C62 C66 = CC0402KRX5R6BB104: as C1 on sheet FRONT_PWR; ManufacturerPartNumber: CC0402KRX5R6BB104; Rem: *
C67 C68 = CC0805KKX7R8BB475: ЧИП конденсатор; Manufacturer: Yageo; ID: 0805 4,7 мкФ 25В X7R; Tolerance: 0,1; Type: X7R; Value: 0805 4,7 мкФ 25В X7R; RuNominal: 4,7 мкФ; Voltage: 25В; ManufacturerPartNumber: CC0805KKX7R8BB475; Rem: *
DA5 = TPS65142RTGR: LCD Bias Power Integrated with WLED Backlight Drivers; Manufacturer: TI; Value: TPS65142RTGR; ComponentLink1Description: datasheet; ComponentLink1URL: https://www.ti.com/lit/ds/symlink/tps65142.pdf?ts=1769084662005&ref_url=https%253A%252F%252Fwww.ti.com%252Fproduct%252FTPS65142; ManufacturerPartNumber: TPS65142RTGR; Rem: *
L6 L7 = 1812PS-103KR: Shielded High SRF Inductors; Manufacturer: Coilcraft; ID: 1812PS 10мкГн 10%; Rem: 10%; Value: 1812PS 10мкГн 10%; Current: 0,9А; DC Res: 0.17; ManufacturerPartNumber: 1812PS-103KR
L8 = BLM18PG121SN1D: as L5 on sheet FRONT_PWR; Nominal: BLM18PG121SN1D; ID: BLM18PG121SN1D; ManufacturerPartNumber: BLM18PG121SN1D; Value: BLM18PG121SN1D
R21 = RC0402JR-07100RL: ЧИП резистор; Manufacturer: Yageo; ID: 0402 100 Ом 5%; Tolerance: 5%; Value: 0402 100 Ом 5%; ManufacturerPartNumber: RC0402JR-07100RL; Rem: *; Type: *
R22 = RC0402JR-07240KL: ЧИП резистор; Manufacturer: Yageo; ID: 0402 240 кОм 5%; Tolerance: 5%; Value: 0402 240 кОм 5%; ManufacturerPartNumber: RC0402JR-07240KL; Rem: *; Type: *
R23 R24 R26 R29 R31 R34 R35 R37 R38 R40-R42 R44 R45 R47 R50 R53-R60 R62-R66 = RC0402JR-0722RL: ЧИП резистор; Manufacturer: Yageo; ID: 0402 22 Ом 5%; Tolerance: 5%; Value: 0402 22 Ом 5%; ManufacturerPartNumber: RC0402JR-0722RL; Rem: *; Type: *
R25 = RC0402JR-07120KL: ЧИП резистор; Manufacturer: Yageo; ID: 0402 120 кОм 5%; Tolerance: 5%; Value: 0402 120 кОм 5%; ManufacturerPartNumber: RC0402JR-07120KL; Rem: *; Type: *
R27 = RC0402JR-07130KL: ЧИП резистор; Manufacturer: Yageo; ID: 0402 130 кОм 5%; Tolerance: 5%; Value: 0402 130 кОм 5%; ManufacturerPartNumber: RC0402JR-07130KL; Rem: *; Type: *
R28 = RC0402JR-0710RL: ЧИП резистор; Manufacturer: Yageo; ID: 0402 10 Ом 5%; Tolerance: 5%; Value: 0402 10 Ом 5%; ManufacturerPartNumber: RC0402JR-0710RL; Rem: *; Type: *
R30 R33 R39 = RC0402JR-0718KL: ЧИП резистор; Manufacturer: Yageo; ID: 0402 18 кОм 5%; Tolerance: 5%; Value: 0402 18 кОм 5%; ManufacturerPartNumber: RC0402JR-0718KL; Rem: *; Type: *
R32 = RC0402JR-0768KL: ЧИП резистор; Manufacturer: Yageo; ID: 0402 68 кОм 5%; Tolerance: 5%; Value: 0402 68 кОм 5%; ManufacturerPartNumber: RC0402JR-0768KL; Rem: *; Type: *
R36 = RC0402JR-0727KL: as R6 on sheet FRONT_PWR; ManufacturerPartNumber: RC0402JR-0727KL; Rem: *; Type: *
R43 = RC0402JR-071KL: ЧИП резистор; Manufacturer: Yageo; ID: 0402 1 кОм 5%; Tolerance: 5%; Value: 0402 1 кОм 5%; ManufacturerPartNumber: RC0402JR-071KL; Rem: *; Type: *
R46 = RC0402JR-0733KL: as R2 on sheet FRONT_PWR; ManufacturerPartNumber: RC0402JR-0733KL; Rem: *; Type: *
R48 R49 = RC0402JR-0710KL: as R1 on sheet FRONT_PWR; ManufacturerPartNumber: RC0402JR-0710KL; Rem: *; Type: *
R51 = RC0402JR-07110KL: ЧИП резистор; Manufacturer: Yageo; ID: 0402 110 кОм 5%; Tolerance: 5%; Value: 0402 110 кОм 5%; ManufacturerPartNumber: RC0402JR-07110KL; Rem: *; Type: *
R52 = RC0402JR-0751RL: ЧИП резистор; Manufacturer: Yageo; ID: 0402 51 Ом 5%; Tolerance: 5%; Value: 0402 51 Ом 5%; ManufacturerPartNumber: RC0402JR-0751RL; Rem: *; Type: *
R61 = RC0402FR-0761K9L: ЧИП резистор; Manufacturer: Yageo; ID: 0402 61,9 кОм 1%; Tolerance: 1%; Value: 0402 61,9 кОм 1%; ManufacturerPartNumber: RC0402FR-0761K9L; Rem: *; Type: *
VD1 VD3 VD4 = BAT54S: SCHOTTKY DIODE; Manufacturer: International Rectifier; Rem: 0.2Amp 30V; Value: BAT54S; ID: BAT54S; ManufacturerPartNumber: BAT54S; datasheet: https://static.chipdip.ru/lib/196/DOC000196695.pdf
VD2 VD5 = B340A: High-Current Density Surface Mount Schottky Rectifier; Manufacturer: Vishay; Rem: 3Amp 40V; Value: B340A; ID: B340A; ManufacturerPartNumber: B340A; datasheet: https://static.chipdip.ru/lib/652/DOC001652710.pdf

## Sheet FRONT_DDR.SchDoc: SDR200
size 420 x 297 mm; DocumentNumber: XXXX.468179.001 Э3; SheetNumber: 4; SheetTotal: 6; Title2str: Передняя панель; DocumentType: Схема электрическая принципиальная; Scale: 1:1
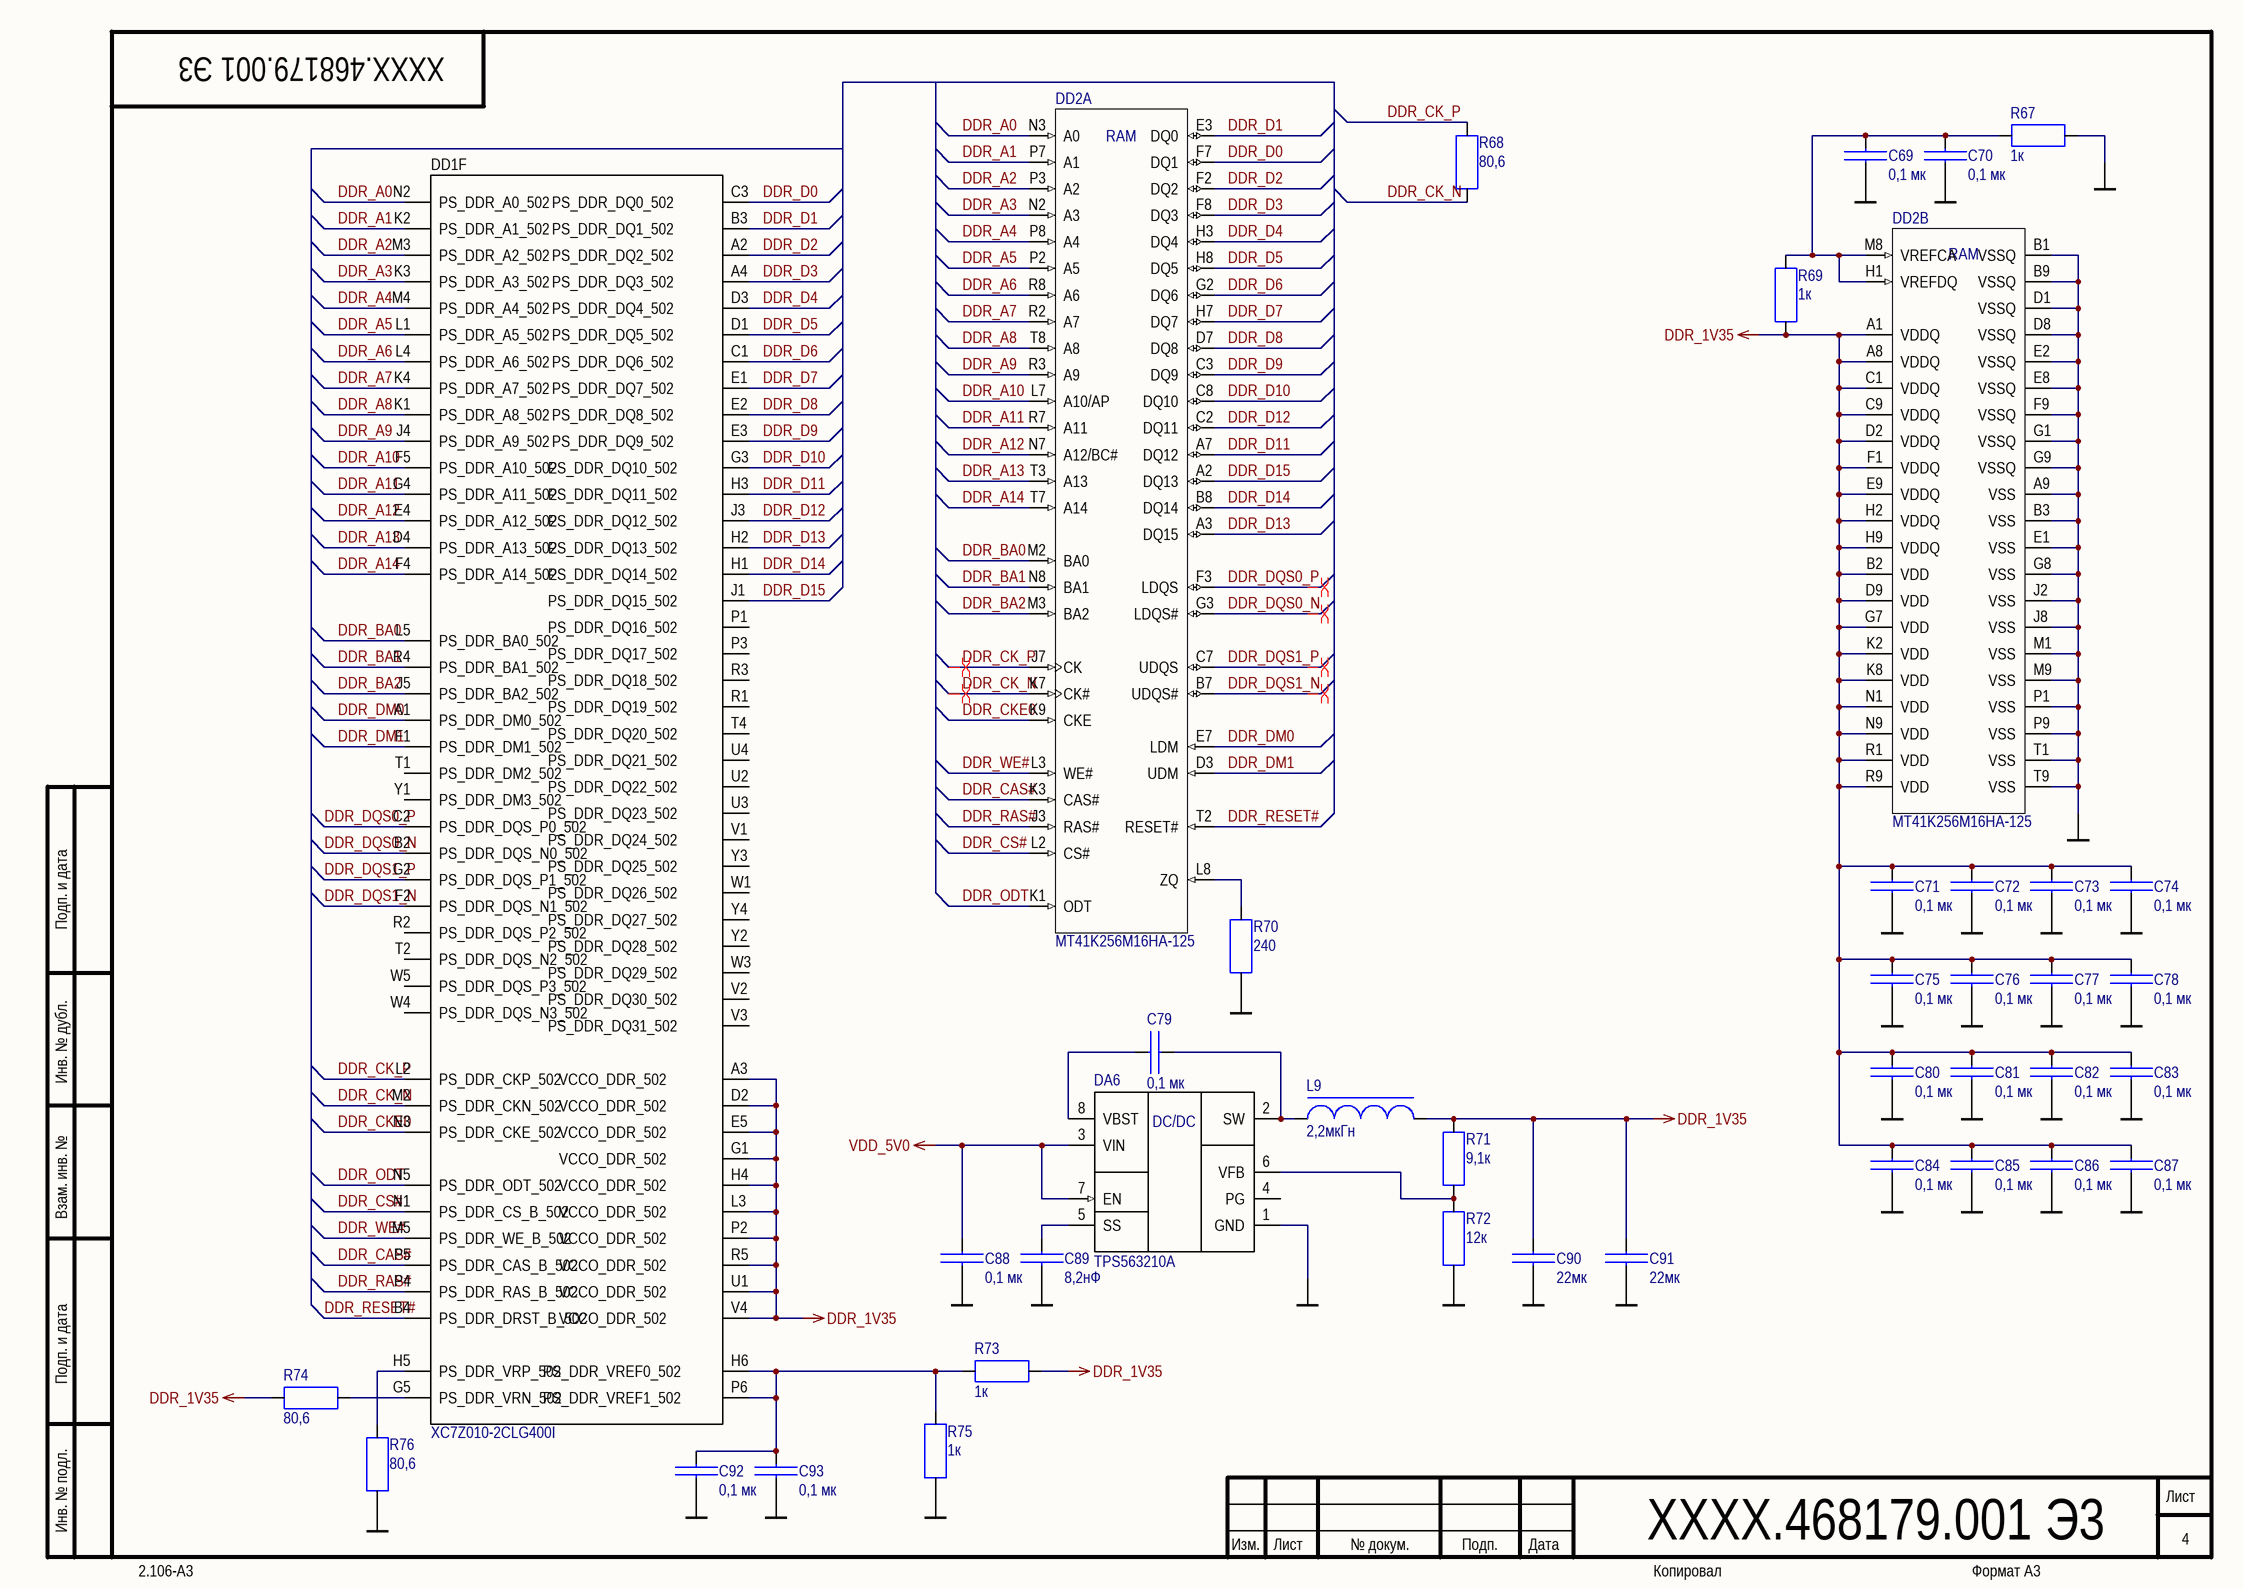
[diagram p3: FRONT_DDR.SchDoc]

### Parts
C69  Nominal: 0,1 мк  [CAPC1005X05L]  (hidden comment: CC0402KRX5R6BB104)
C70  Nominal: 0,1 мк  [CAPC1005X05L]  (hidden comment: CC0402KRX5R6BB104)
C71  Nominal: 0,1 мк  [CAPC1005X05L]  (hidden comment: CC0402KRX5R6BB104)
C72  Nominal: 0,1 мк  [CAPC1005X05L]  (hidden comment: CC0402KRX5R6BB104)
C73  Nominal: 0,1 мк  [CAPC1005X05L]  (hidden comment: CC0402KRX5R6BB104)
C74  Nominal: 0,1 мк  [CAPC1005X05L]  (hidden comment: CC0402KRX5R6BB104)
C75  Nominal: 0,1 мк  [CAPC1005X05L]  (hidden comment: CC0402KRX5R6BB104)
C76  Nominal: 0,1 мк  [CAPC1005X05L]  (hidden comment: CC0402KRX5R6BB104)
C77  Nominal: 0,1 мк  [CAPC1005X05L]  (hidden comment: CC0402KRX5R6BB104)
C78  Nominal: 0,1 мк  [CAPC1005X05L]  (hidden comment: CC0402KRX5R6BB104)
C79  Nominal: 0,1 мк  [CAPC1005X05L]  (hidden comment: CC0402KRX5R6BB104)
C80  Nominal: 0,1 мк  [CAPC1005X05L]  (hidden comment: CC0402KRX5R6BB104)
C81  Nominal: 0,1 мк  [CAPC1005X05L]  (hidden comment: CC0402KRX5R6BB104)
C82  Nominal: 0,1 мк  [CAPC1005X05L]  (hidden comment: CC0402KRX5R6BB104)
C83  Nominal: 0,1 мк  [CAPC1005X05L]  (hidden comment: CC0402KRX5R6BB104)
C84  Nominal: 0,1 мк  [CAPC1005X05L]  (hidden comment: CC0402KRX5R6BB104)
C85  Nominal: 0,1 мк  [CAPC1005X05L]  (hidden comment: CC0402KRX5R6BB104)
C86  Nominal: 0,1 мк  [CAPC1005X05L]  (hidden comment: CC0402KRX5R6BB104)
C87  Nominal: 0,1 мк  [CAPC1005X05L]  (hidden comment: CC0402KRX5R6BB104)
C88  Nominal: 0,1 мк  [CAPC1005X05L]  (hidden comment: CC0402KRX5R6BB104)
C89  Nominal: 8,2нФ  [CAPC1005X05L]  (hidden comment: CC0402KRX7R9BB822)
C90  Nominal: 22мк  [CAPC2012X09L]  (hidden comment: CC0805MKX5R5BB226)
C91  Nominal: 22мк  [CAPC2012X09L]  (hidden comment: CC0805MKX5R5BB226)
C92  Nominal: 0,1 мк  [CAPC1005X05L]  (hidden comment: CC0402KRX5R6BB104)
C93  Nominal: 0,1 мк  [CAPC1005X05L]  (hidden comment: CC0402KRX5R6BB104)
DA6  TPS563210A  [TSOP65P280X110-8L]
DD1  XC7Z010-2CLG400I  [BGA400C80P20X20_1700X1700X147]  (part F of 7)
DD2  MT41K256M16HA-125  [BGA96C80P9X16_800X1400X110]  (parts A,B of 2)
L9  Nominal: 2,2мкГн  [INDCXGL4020]  (hidden comment: XGL4020-222ME)
R67  Nominal: 1к  [RESC1005X04L]  (hidden comment: RC0402JR-071KL)
R68  Nominal: 80,6  [RESC1005X04L]  (hidden comment: RC0402FR-0780R6L)
R69  Nominal: 1к  [RESC1005X04L]  (hidden comment: RC0402JR-071KL)
R70  Nominal: 240  [RESC1005X04L]  (hidden comment: RC0402JR-07240RL)
R71  Nominal: 9,1к  [RESC1005X04L]  (hidden comment: RC0402JR-079K1L)
R72  Nominal: 12к  [RESC1005X04L]  (hidden comment: RC0402JR-0712KL)
R73  Nominal: 1к  [RESC1005X04L]  (hidden comment: RC0402JR-071KL)
R74  Nominal: 80,6  [RESC1005X04L]  (hidden comment: RC0402FR-0780R6L)
R75  Nominal: 1к  [RESC1005X04L]  (hidden comment: RC0402JR-071KL)
R76  Nominal: 80,6  [RESC1005X04L]  (hidden comment: RC0402FR-0780R6L)

### Nets
DDR_1V35: C71.2 C72.2 C73.2 C74.2 C75.2 C76.2 C77.2 C78.2 C80.2 C81.2 C82.2 C83.2 C84.2 C85.2 C86.2 C87.2 C90.2 C91.2 DD1.A3(VCCO_DDR_502) DD1.D2(VCCO_DDR_502) DD1.E5(VCCO_DDR_502) DD1.G1(VCCO_DDR_502) DD1.H4(VCCO_DDR_502) DD1.L3(VCCO_DDR_502) DD1.P2(VCCO_DDR_502) DD1.R5(VCCO_DDR_502) DD1.U1(VCCO_DDR_502) DD1.V4(VCCO_DDR_502) DD2.A1(VDDQ) DD2.A8(VDDQ) DD2.B2(VDD) DD2.C1(VDDQ) DD2.C9(VDDQ) DD2.D2(VDDQ) DD2.D9(VDD) DD2.E9(VDDQ) DD2.F1(VDDQ) DD2.G7(VDD) DD2.H2(VDDQ) DD2.H9(VDDQ) DD2.K2(VDD) DD2.K8(VDD) DD2.N1(VDD) DD2.N9(VDD) DD2.R1(VDD) DD2.R9(VDD) L9.1 R69.2 R71.1 R73.1 R74.2
GND: C69.1 C70.1 C71.1 C72.1 C73.1 C74.1 C75.1 C76.1 C77.1 C78.1 C80.1 C81.1 C82.1 C83.1 C84.1 C85.1 C86.1 C87.1 C88.1 C89.1 C90.1 C91.1 C92.1 C93.1 DA6.1(GND) DD2.A9(VSS) DD2.B1(VSSQ) DD2.B3(VSS) DD2.B9(VSSQ) DD2.D1(VSSQ) DD2.D8(VSSQ) DD2.E1(VSS) DD2.E2(VSSQ) DD2.E8(VSSQ) DD2.F9(VSSQ) DD2.G1(VSSQ) DD2.G8(VSS) DD2.G9(VSSQ) DD2.J2(VSS) DD2.J8(VSS) DD2.M1(VSS) DD2.M9(VSS) DD2.P1(VSS) DD2.P9(VSS) DD2.T1(VSS) DD2.T9(VSS) R67.2 R70.1 R72.2 R75.1 R76.1
VDD_5V0: C88.2 DA6.3(VIN) DA6.7(EN)  [project net BL_PWR]
DDR_A0: DD1.N2(PS_DDR_A0_502) DD2.N3(A0)
DDR_A1: DD1.K2(PS_DDR_A1_502) DD2.P7(A1)
DDR_A2: DD1.M3(PS_DDR_A2_502) DD2.P3(A2)
DDR_A3: DD1.K3(PS_DDR_A3_502) DD2.N2(A3)
DDR_A4: DD1.M4(PS_DDR_A4_502) DD2.P8(A4)
DDR_A5: DD1.L1(PS_DDR_A5_502) DD2.P2(A5)
DDR_A6: DD1.L4(PS_DDR_A6_502) DD2.R8(A6)
DDR_A7: DD1.K4(PS_DDR_A7_502) DD2.R2(A7)
DDR_A8: DD1.K1(PS_DDR_A8_502) DD2.T8(A8)
DDR_A9: DD1.J4(PS_DDR_A9_502) DD2.R3(A9)
DDR_A10: DD1.F5(PS_DDR_A10_502) DD2.L7(A10/AP)
DDR_A11: DD1.G4(PS_DDR_A11_502) DD2.R7(A11)
DDR_A12: DD1.E4(PS_DDR_A12_502) DD2.N7(A12/BC#)
DDR_A13: DD1.D4(PS_DDR_A13_502) DD2.T3(A13)
DDR_A14: DD1.F4(PS_DDR_A14_502) DD2.T7(A14)
DDR_BA0: DD1.L5(PS_DDR_BA0_502) DD2.M2(BA0)
DDR_BA1: DD1.R4(PS_DDR_BA1_502) DD2.N8(BA1)
DDR_BA2: DD1.J5(PS_DDR_BA2_502) DD2.M3(BA2)
DDR_CAS#: DD1.P5(PS_DDR_CAS_B_502) DD2.K3(CAS#)
DDR_CK_N: DD1.M2(PS_DDR_CKN_502) DD2.K7(CK#) R68.1
DDR_CK_P: DD1.L2(PS_DDR_CKP_502) DD2.J7(CK) R68.2
DDR_CKE0: DD1.N3(PS_DDR_CKE_502) DD2.K9(CKE)
DDR_CS#: DD1.N1(PS_DDR_CS_B_502) DD2.L2(CS#)
DDR_D0: DD1.C3(PS_DDR_DQ0_502) DD2.F7(DQ1)
DDR_D1: DD1.B3(PS_DDR_DQ1_502) DD2.E3(DQ0)
DDR_D2: DD1.A2(PS_DDR_DQ2_502) DD2.F2(DQ2)
DDR_D3: DD1.A4(PS_DDR_DQ3_502) DD2.F8(DQ3)
DDR_D4: DD1.D3(PS_DDR_DQ4_502) DD2.H3(DQ4)
DDR_D5: DD1.D1(PS_DDR_DQ5_502) DD2.H8(DQ5)
DDR_D6: DD1.C1(PS_DDR_DQ6_502) DD2.G2(DQ6)
DDR_D7: DD1.E1(PS_DDR_DQ7_502) DD2.H7(DQ7)
DDR_D8: DD1.E2(PS_DDR_DQ8_502) DD2.D7(DQ8)
DDR_D9: DD1.E3(PS_DDR_DQ9_502) DD2.C3(DQ9)
DDR_D10: DD1.G3(PS_DDR_DQ10_502) DD2.C8(DQ10)
DDR_D11: DD1.H3(PS_DDR_DQ11_502) DD2.A7(DQ12)
DDR_D12: DD1.J3(PS_DDR_DQ12_502) DD2.C2(DQ11)
DDR_D13: DD1.H2(PS_DDR_DQ13_502) DD2.A3(DQ15)
DDR_D14: DD1.H1(PS_DDR_DQ14_502) DD2.B8(DQ14)
DDR_D15: DD1.J1(PS_DDR_DQ15_502) DD2.A2(DQ13)
DDR_DM0: DD1.A1(PS_DDR_DM0_502) DD2.E7(LDM)
DDR_DM1: DD1.F1(PS_DDR_DM1_502) DD2.D3(UDM)
DDR_DQS0_N: DD1.B2(PS_DDR_DQS_N0_502) DD2.G3(LDQS#)
DDR_DQS0_P: DD1.C2(PS_DDR_DQS_P0_502) DD2.F3(LDQS)
DDR_DQS1_N: DD1.F2(PS_DDR_DQS_N1_502) DD2.B7(UDQS#)
DDR_DQS1_P: DD1.G2(PS_DDR_DQS_P1_502) DD2.C7(UDQS)
DDR_ODT: DD1.N5(PS_DDR_ODT_502) DD2.K1(ODT)
DDR_RAS#: DD1.P4(PS_DDR_RAS_B_502) DD2.J3(RAS#)
DDR_RESET#: DD1.B4(PS_DDR_DRST_B_502) DD2.T2(RESET#)
DDR_WE#: DD1.M5(PS_DDR_WE_B_502) DD2.L3(WE#)
NetC69_2: C69.2 C70.2 DD2.H1(VREFDQ) DD2.M8(VREFCA) R67.1 R69.1
NetC79_1: C79.1 DA6.8(VBST)
NetC79_2: C79.2 DA6.2(SW) L9.2
NetC89_2: C89.2 DA6.5(SS)
NetC92_2: C92.2 C93.2 DD1.H6(PS_DDR_VREF0_502) DD1.P6(PS_DDR_VREF1_502) R73.2 R75.2
NetDA6_6: DA6.6(VFB) R71.2 R72.1
NetDD1_G5   : DD1.G5(PS_DDR_VRN_502) R74.1
NetDD1_H5   : DD1.H5(PS_DDR_VRP_502) R76.2
NetDD2_L8: DD2.L8(ZQ) R70.2

Not connected (* = marked no-connect by the designer): DA6 4(PG); DD1 P1   (PS_DDR_DQ16_502__________) P3   (PS_DDR_DQ17_502__________) R1   (PS_DDR_DQ19_502__________) R2   (PS_DDR_DQS_P2_502________) R3   (PS_DDR_DQ18_502__________) T1   (PS_DDR_DM2_502___________) T2   (PS_DDR_DQS_N2_502________) T4   (PS_DDR_DQ20_502__________) U2   (PS_DDR_DQ22_502__________) U3   (PS_DDR_DQ23_502__________) U4   (PS_DDR_DQ21_502__________) V1   (PS_DDR_DQ24_502__________) V2   (PS_DDR_DQ30_502__________) V3   (PS_DDR_DQ31_502__________) W1   (PS_DDR_DQ26_502__________) W3   (PS_DDR_DQ29_502__________) W4   (PS_DDR_DQS_N3_502________) W5   (PS_DDR_DQS_P3_502________) Y1   (PS_DDR_DM3_502___________) Y2   (PS_DDR_DQ28_502__________) Y3   (PS_DDR_DQ25_502__________) Y4   (PS_DDR_DQ27_502__________)

### Layout directives
differential pair: DDR_CK_N, DDR_CK_P, DDR_DQS0_N, DDR_DQS0_P, DDR_DQS1_N, DDR_DQS1_P

### Notes on the sheet
- Подп. и дата
- Инв. № дубл.
- Взам. инв. №
- Инв. № подл.
- Изм.
- Лист
- № докум.
- Подп.
- Дата
- 2.106-A3
- Копировал
- Формат А3
- (in symbol MT41K256M16HA-125, part A) RAM
- (in symbol MT41K256M16HA-125, part B) RAM
- (in symbol TPS563210A) DC/DC

### Library data of the parts
C69-C88 C92 C93 = CC0402KRX5R6BB104: as C1 on sheet FRONT_PWR; ManufacturerPartNumber: CC0402KRX5R6BB104; Rem: *
C89 = CC0402KRX7R9BB822: as C3 on sheet FRONT_PWR; ManufacturerPartNumber: CC0402KRX7R9BB822; Rem: *
C90 C91 = CC0805MKX5R5BB226: as C4 on sheet FRONT_PWR; ManufacturerPartNumber: CC0805MKX5R5BB226; Rem: *
DA6 = TPS563210A: as DA1 on sheet FRONT_PWR; Value: TPS563210A; ComponentLink1Description: datasheet; ComponentLink1URL: https://www.ti.com/lit/ds/symlink/tps563210a.pdf?ts=1769179342855&ref_url=https%253A%252F%252Fwww.ti.com%252Fproduct%252FTPS563210A; ManufacturerPartNumber: TPS563210A; Rem: *
DD1 = XC7Z010-2CLG400I: as DD1 on sheet FRONT_PWR; ManufacturerPartNumber: XC7Z010-2CLG400I; Value: XC7Z010-2CLG400I
DD2 = MT41K256M16HA-125: 4Gb, x16, 1.35V DDR3L; Manufacturer: Micron; ManufacturerPartNumber: MT41K256M16HA-125; Value: MT41K256M16HA-125
L9 = XGL4020-222ME: as L1 on sheet FRONT_PWR; ManufacturerPartNumber: XGL4020-222ME
R67 R69 R73 R75 = RC0402JR-071KL: as R43 on sheet FRONT_LCD; ManufacturerPartNumber: RC0402JR-071KL; Rem: *; Type: *
R68 R74 R76 = RC0402FR-0780R6L: ЧИП резистор; Manufacturer: Yageo; ID: 0402 80,6 Ом 1%; Tolerance: 1%; Value: 0402 80,6 Ом 1%; ManufacturerPartNumber: RC0402FR-0780R6L; Rem: *; Type: *
R70 = RC0402JR-07240RL: ЧИП резистор; Manufacturer: Yageo; ID: 0402 240 Ом 5%; Tolerance: 5%; Value: 0402 240 Ом 5%; ManufacturerPartNumber: RC0402JR-07240RL; Rem: *; Type: *
R71 = RC0402JR-079K1L: ЧИП резистор; Manufacturer: Yageo; ID: 0402 9,1 кОм 5%; Tolerance: 5%; Value: 0402 9,1 кОм 5%; ManufacturerPartNumber: RC0402JR-079K1L; Rem: *; Type: *
R72 = RC0402JR-0712KL: ЧИП резистор; Manufacturer: Yageo; ID: 0402 12 кОм 5%; Tolerance: 5%; Value: 0402 12 кОм 5%; ManufacturerPartNumber: RC0402JR-0712KL; Rem: *; Type: *

## Sheet FRONT_PS.SchDoc: SDR200
size 420 x 297 mm; DocumentNumber: XXXX.468179.001 Э3; SheetNumber: 5; SheetTotal: 7; Title2str: Передняя панель; DocumentType: Схема электрическая принципиальная; Scale: 1:1
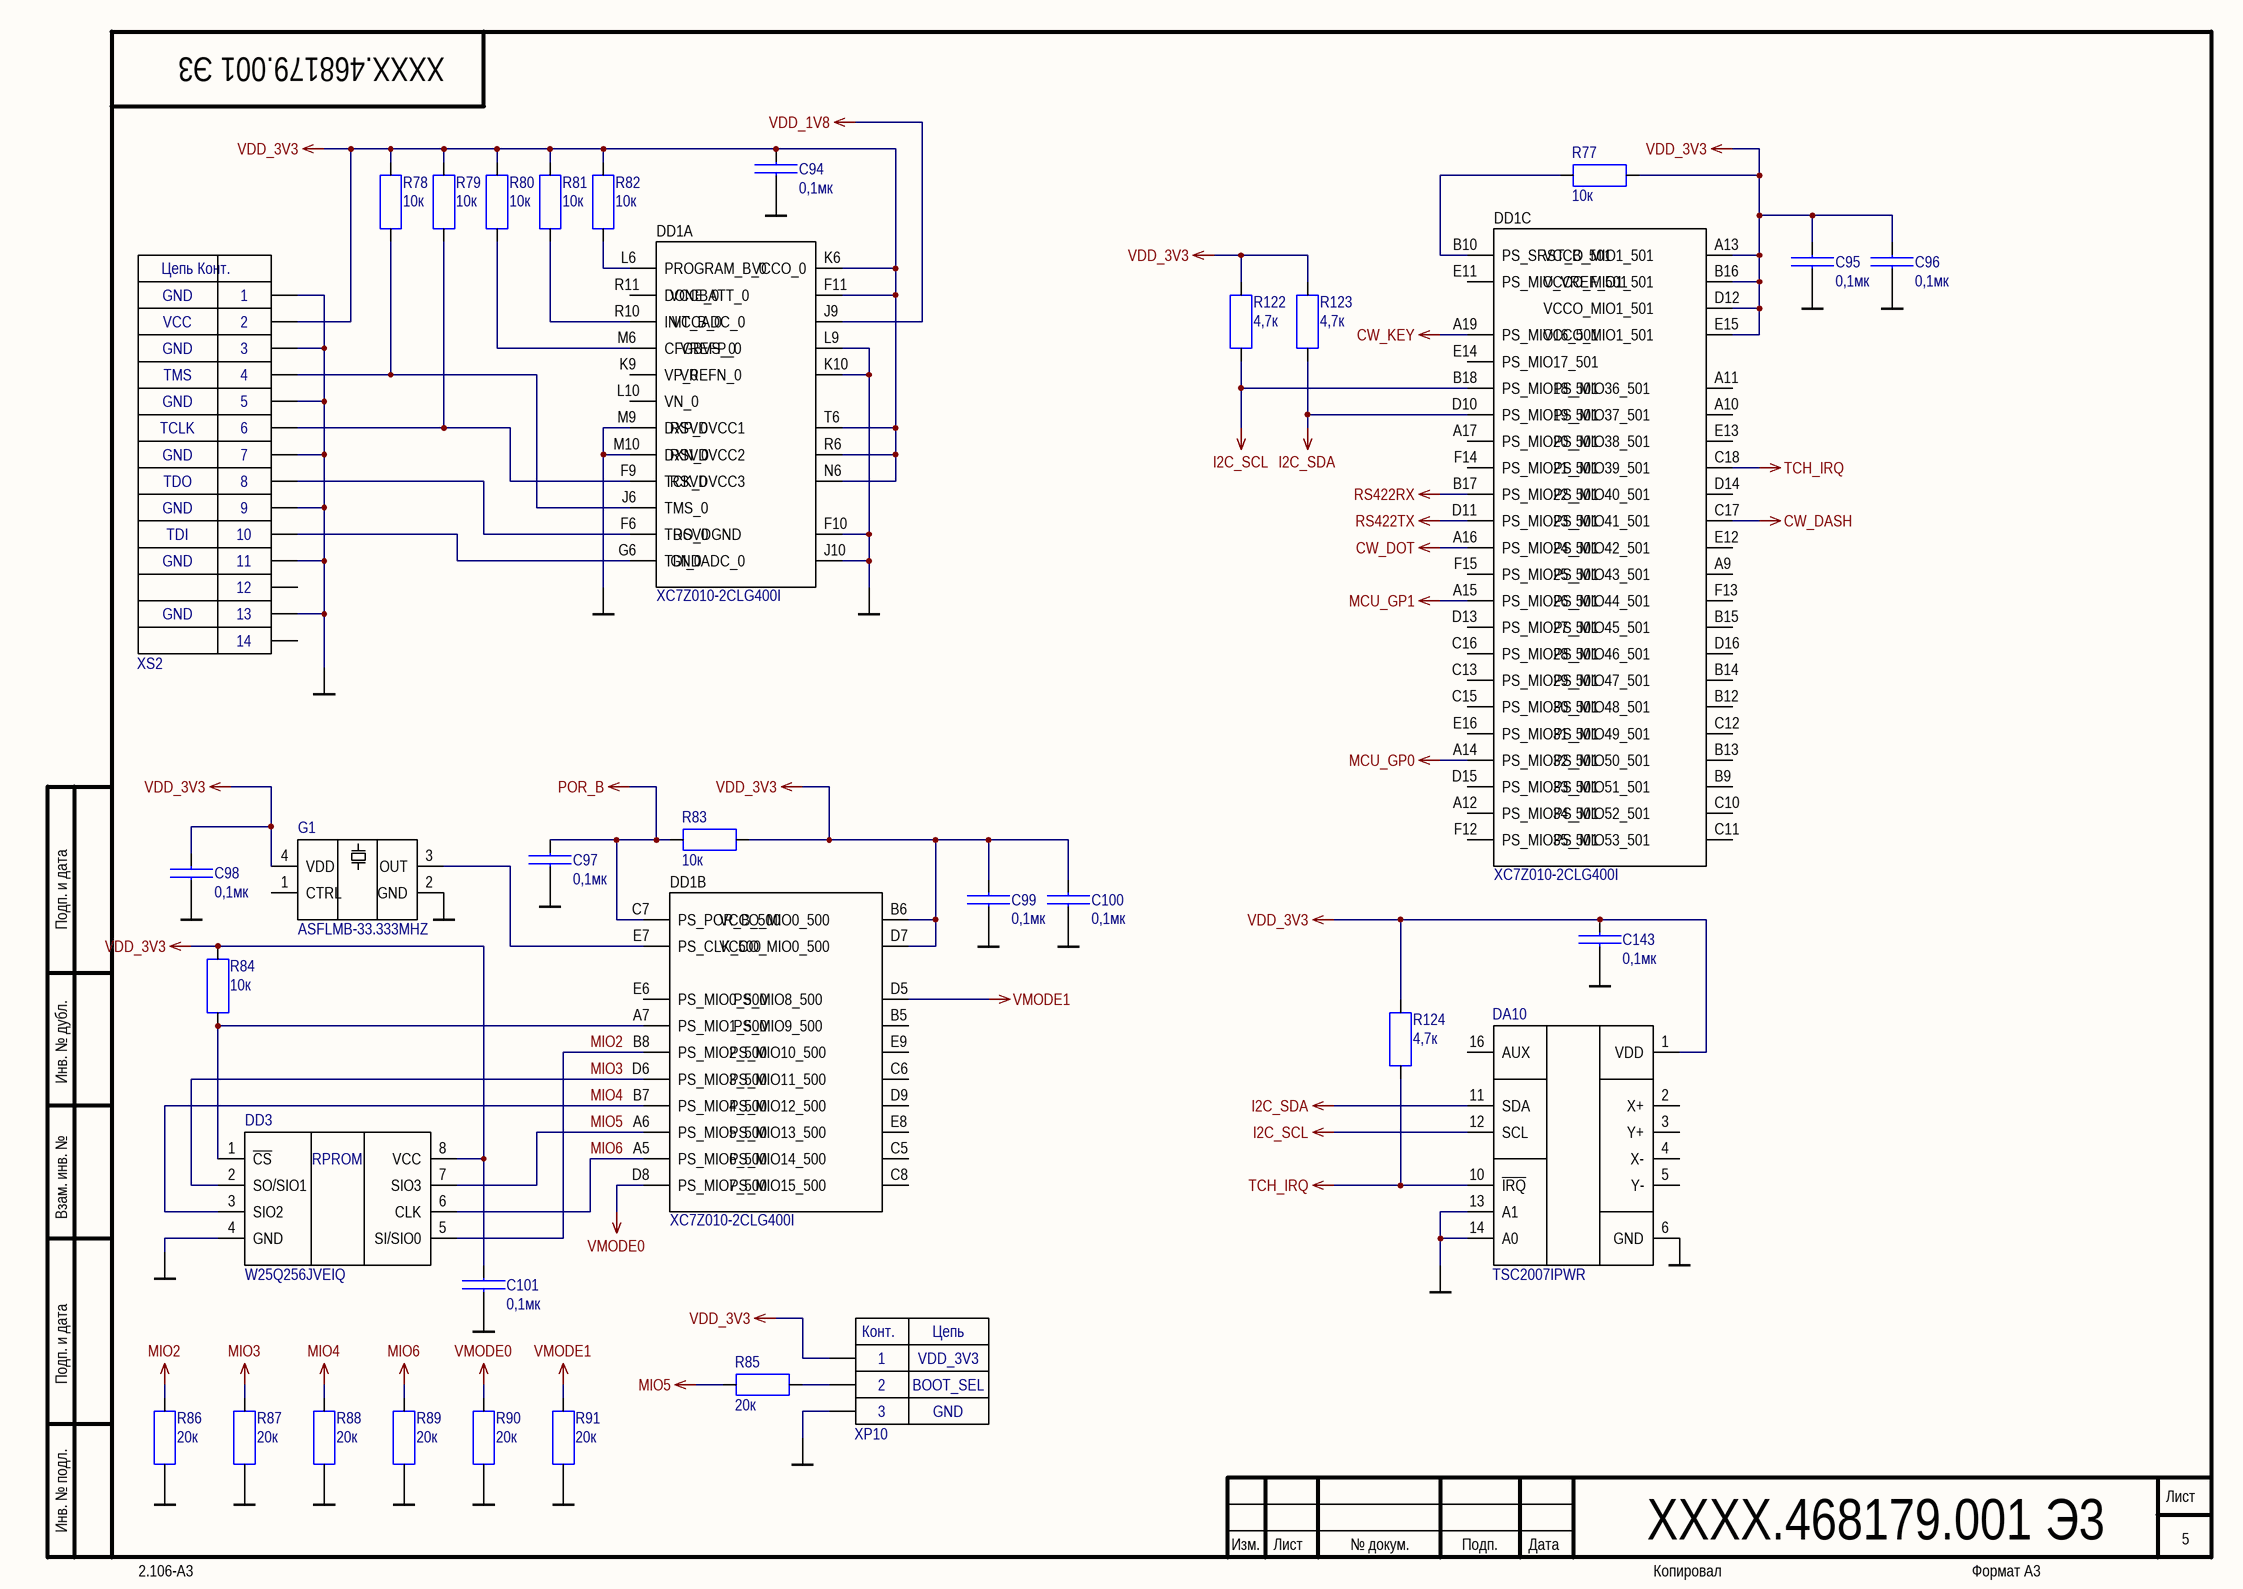
[diagram p4: FRONT_PS.SchDoc]

### Parts
C94  Nominal: 0,1мк  [CAPC1005X05L]  (hidden comment: CC0402KRX5R6BB104)
C95  Nominal: 0,1мк  [CAPC1005X05L]  (hidden comment: CC0402KRX5R6BB104)
C96  Nominal: 0,1мк  [CAPC1005X05L]  (hidden comment: CC0402KRX5R6BB104)
C97  Nominal: 0,1мк  [CAPC1005X05L]  (hidden comment: CC0402KRX5R6BB104)
C98  Nominal: 0,1мк  [CAPC1005X05L]  (hidden comment: CC0402KRX5R6BB104)
C99  Nominal: 0,1мк  [CAPC1005X05L]  (hidden comment: CC0402KRX5R6BB104)
C100  Nominal: 0,1мк  [CAPC1005X05L]  (hidden comment: CC0402KRX5R6BB104)
C101  Nominal: 0,1мк  [CAPC1005X05L]  (hidden comment: CC0402KRX5R6BB104)
C143  Nominal: 0,1мк  [CAPC1005X05L]  (hidden comment: CC0402KRX5R6BB104)
DA10  TSC2007IPWR  [TSOP65P640X120-16N]
DD1  XC7Z010-2CLG400I  [BGA400C80P20X20_1700X1700X147]  (parts A,B,C of 7)
DD3  W25Q256JVEIQ  [SON127P800X70_HS-9N]
G1  ASFLMB-33.333MHZ  [XTAL_ASFLMB-33.333MHZ-LC-T]
R77  Nominal: 10к  [RESC1005X04L]  (hidden comment: RC0402JR-0710KL)
R78  Nominal: 10к  [RESC1005X04L]  (hidden comment: RC0402JR-0710KL)
R79  Nominal: 10к  [RESC1005X04L]  (hidden comment: RC0402JR-0710KL)
R80  Nominal: 10к  [RESC1005X04L]  (hidden comment: RC0402JR-0710KL)
R81  Nominal: 10к  [RESC1005X04L]  (hidden comment: RC0402JR-0710KL)
R82  Nominal: 10к  [RESC1005X04L]  (hidden comment: RC0402JR-0710KL)
R83  Nominal: 10к  [RESC1005X04L]  (hidden comment: RC0402JR-0710KL)
R84  Nominal: 10к  [RESC1005X04L]  (hidden comment: RC0402JR-0710KL)
R85  Nominal: 20к  [RESC1005X04L]  (hidden comment: RC0402JR-0720KL)
R86  Nominal: 20к  [RESC1005X04L]  (hidden comment: RC0402JR-0720KL)
R87  Nominal: 20к  [RESC1005X04L]  (hidden comment: RC0402JR-0720KL)
R88  Nominal: 20к  [RESC1005X04L]  (hidden comment: RC0402JR-0720KL)
R89  Nominal: 20к  [RESC1005X04L]  (hidden comment: RC0402JR-0720KL)
R90  Nominal: 20к  [RESC1005X04L]  (hidden comment: RC0402JR-0720KL)
R91  Nominal: 20к  [RESC1005X04L]  (hidden comment: RC0402JR-0720KL)
R122  Nominal: 4,7к  [RESC1005X04L]  (hidden comment: RC0402JR-074K7L)
R123  Nominal: 4,7к  [RESC1005X04L]  (hidden comment: RC0402JR-074K7L)
R124  Nominal: 4,7к  [RESC1005X04L]  (hidden comment: RC0402JR-074K7L)
XP10  PLS-3  [PLS-3 (DS1021-1x3)]  (value not drawn)
XS2  IDC2-14MS  [IDC2-14MS]  (value not drawn)

### Nets
CW_DASH: DD1.C17(PS_MIO41_501)
CW_DOT: DD1.A16(PS_MIO24_501)
CW_KEY: DD1.A19(PS_MIO16_501)
GND: C94.1 C95.1 C96.1 C97.1 C98.1 C99.1 C100.1 C101.1 C143.1 DA10.6(GND) DA10.13(A1) DA10.14(A0) DD1.F10(RSVDGND) DD1.J10(GNDADC_0) DD1.K10(VREFN_0) DD1.L9(VREFP_0) DD1.M9(DXP_0) DD1.M10(DXN_0) DD3.4(GND) G1.2(GND) R86.2 R87.2 R88.2 R89.2 R90.2 R91.2 XP10.3 XS2.1 XS2.3 XS2.5 XS2.7 XS2.9 XS2.11 XS2.13
I2C_SCL: DA10.12(SCL) DD1.B18(PS_MIO18_501) R122.1
I2C_SDA: DA10.11(SDA) DD1.D10(PS_MIO19_501) R123.1
MCU_GP0: DD1.A14(PS_MIO32_501)
MCU_GP1: DD1.A15(PS_MIO26_501)
MIO2: DD1.B8(PS_MIO2_500) DD3.5(SI/SIO0) R86.1
MIO3: DD1.D6(PS_MIO3_500) DD3.2(SO/SIO1) R87.1
MIO4: DD1.B7(PS_MIO4_500) DD3.3(SIO2) R88.1
MIO5: DD1.A6(PS_MIO5_500) DD3.7(SIO3) R85.1
MIO6: DD1.A5(PS_MIO6_500) DD3.6(CLK) R89.1
POR_B: C97.2 DD1.C7(PS_POR_B_500) R83.1
RS422RX: DD1.B17(PS_MIO22_501)
RS422TX: DD1.D11(PS_MIO23_501)
TCH_IRQ: DA10.10(~{IRQ}) DD1.C18(PS_MIO39_501) R124.1
VDD_1V8: DD1.J9(VCCADC_0)
VDD_3V3: C94.2 C95.2 C96.2 C98.2 C99.2 C100.2 C101.2 C143.2 DA10.1(VDD) DD1.A13(VCCO_MIO1_501) DD1.B6(VCCO_MIO0_500) DD1.B16(VCCO_MIO1_501) DD1.D7(VCCO_MIO0_500) DD1.D12(VCCO_MIO1_501) DD1.E15(VCCO_MIO1_501) DD1.F11(VCCBATT_0) DD1.K6(VCCO_0) DD1.N6(RSVDVCC3) DD1.R6(RSVDVCC2) DD1.T6(RSVDVCC1) DD3.8(VCC) G1.4(VDD) R77.2 R78.2 R79.2 R80.2 R81.2 R82.2 R83.2 R84.2 R122.2 R123.2 R124.2 XP10.1 XS2.2
VMODE0: DD1.D8(PS_MIO7_500) R90.1
VMODE1: DD1.D5(PS_MIO8_500) R91.1
NetDD1_A7   : DD1.A7(PS_MIO1_500) DD3.1(~{CS}) R84.1
NetDD1_B10  : DD1.B10(PS_SRST_B_501) R77.1
NetDD1_E7   : DD1.E7(PS_CLK_500) G1.3(OUT)
NetDD1_F6   : DD1.F6(TDO_0) XS2.8
NetDD1_F9   : DD1.F9(TCK_0) R79.1 XS2.6
NetDD1_G6   : DD1.G6(TDI_0) XS2.10
NetDD1_J6   : DD1.J6(TMS_0) R78.1 XS2.4
NetDD1_L6   : DD1.L6(PROGRAM_B_0) R82.1
NetDD1_M6   : DD1.M6(CFGBVS_0) R80.1
NetDD1_R10  : DD1.R10(INIT_B_0) R81.1
NetR85_2: R85.2 XP10.2

Not connected (* = marked no-connect by the designer): DA10 2(X+) 3(Y+) 4(X-) 5(Y-) 16(AUX); DD1 A9   (PS_MIO43_501_____________) A10  (PS_MIO37_501_____________) A11  (PS_MIO36_501_____________) A12  (PS_MIO34_501_____________) A17  (PS_MIO20_501_____________) B5   (PS_MIO9_500______________) B9   (PS_MIO51_501_____________) B12  (PS_MIO48_501_____________) B13  (PS_MIO50_501_____________) B14  (PS_MIO47_501_____________) B15  (PS_MIO45_501_____________) C5   (PS_MIO14_500_____________) C6   (PS_MIO11_500_____________) C8   (PS_MIO15_500_____________) C10  (PS_MIO52_501_____________) C11  (PS_MIO53_501_____________) C12  (PS_MIO49_501_____________) C13  (PS_MIO29_501_____________) C15  (PS_MIO30_501_____________) C16  (PS_MIO28_501_____________) D9   (PS_MIO12_500_____________) D13  (PS_MIO27_501_____________) D14  (PS_MIO40_501_____________) D15  (PS_MIO33_501_____________) D16  (PS_MIO46_501_____________) E6   (PS_MIO0_500______________) E8   (PS_MIO13_500_____________) E9   (PS_MIO10_500_____________) E11  (PS_MIO_VREF_501__________) E12  (PS_MIO42_501_____________) E13  (PS_MIO38_501_____________) E14  (PS_MIO17_501_____________) E16  (PS_MIO31_501_____________) F12  (PS_MIO35_501_____________) F13  (PS_MIO44_501_____________) F14  (PS_MIO21_501_____________) F15  (PS_MIO25_501_____________) K9   (VP_0_____________________) L10  (VN_0_____________________) R11  (DONE_0___________________); G1 1(CTRL); XS2 12 14

### Notes on the sheet
- GND
- VDD_3V3
- BOOT_SEL
- Подп. и дата
- Инв. № дубл.
- Взам. инв. №
- Инв. № подл.
- Изм.
- Лист
- № докум.
- Подп.
- Дата
- 2.106-A3
- Копировал
- Формат А3
- (in symbol JTAG Xilinx IDC2-14MS) Цепь; Конт.; GND; VCC; TMS; TCLK; TDO; TDI
- (in symbol PLS-3) Конт.; Цепь
- (in symbol W25Q256JVEIQ) RPROM

### Library data of the parts
C94-C101 C143 = CC0402KRX5R6BB104: as C1 on sheet FRONT_PWR; ManufacturerPartNumber: CC0402KRX5R6BB104; Rem: *
DA10 = TSC2007IPWR: 1.2V to 3.6V, 12-Bit, Nanopower, 4-Wire Micro TOUCH SCREEN CONTROLLER with I / 2C™ Interface; Manufacturer: TI; Value: TSC2007IPWR; ComponentLink1Description: datasheet; ComponentLink1URL: https://static.chipdip.ru/lib/346/DOC032346667.pdf; ManufacturerPartNumber: TSC2007IPWR; Rem: *
DD1 = XC7Z010-2CLG400I: as DD1 on sheet FRONT_PWR; ManufacturerPartNumber: XC7Z010-2CLG400I; Value: XC7Z010-2CLG400I
DD3 = W25Q256JVEIQ: 3V 256M-BIT SERIAL FLASH MEMORY WITH DUAL/QUAD SPI; Manufacturer: WINBOND; ManufacturerPartNumber: W25Q256JVEIQ; Value: W25Q256JVEIQ
G1 = Генератор кварцевый ASFLMB-33.333MHZ: 33.333 MHz HCMOS/TTL Clock Oscillator; Manufacturer: Abracom; ManufacturerPartNumber: ASFLMB-33.333MHZ-LC; Value: 33.333 MHz
R77-R84 = RC0402JR-0710KL: as R1 on sheet FRONT_PWR; ManufacturerPartNumber: RC0402JR-0710KL; Rem: *; Type: *
R85-R91 = RC0402JR-0720KL: as R8 on sheet FRONT_PWR; ManufacturerPartNumber: RC0402JR-0720KL; Rem: *; Type: *
R122-R124 = RC0402JR-074K7L: ЧИП резистор; Manufacturer: Yageo; ID: 0402 4,7 кОм 5%; Tolerance: 5%; Value: 0402 4,7 кОм 5%; ManufacturerPartNumber: RC0402JR-074K7L; Rem: *; Type: *
XS2 = JTAG Xilinx IDC2-14MS